# EAGLE schematic iot-gateway-main (EAGLE 9.6.1)
CNAME: PepeTech; CREVISION: 2.0; DESIGNER: Joao Silva

## Sheet 1 of 9: Main MCU
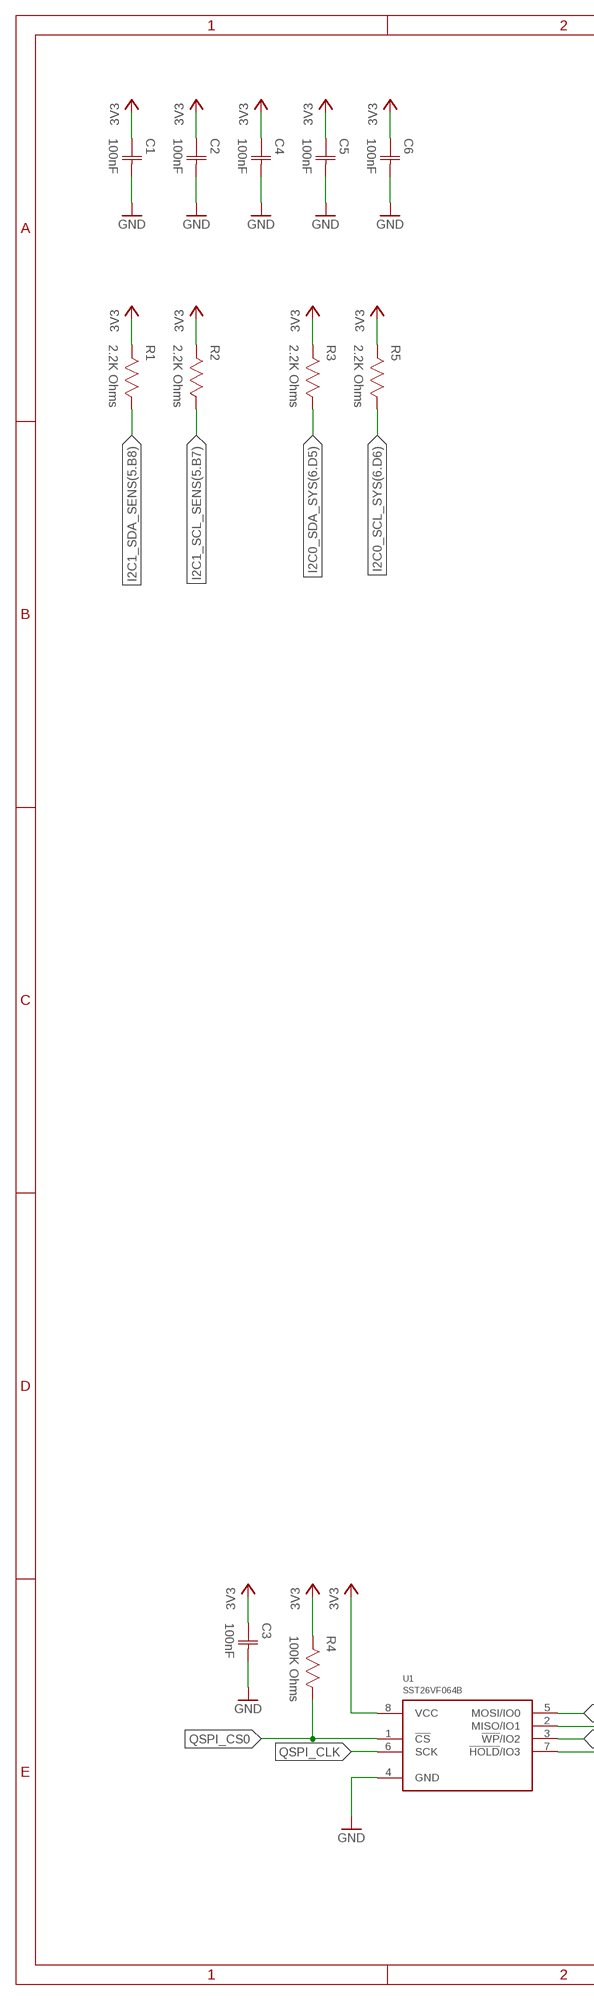
[diagram p0: schematic, sheet 1, part 1 of 2]
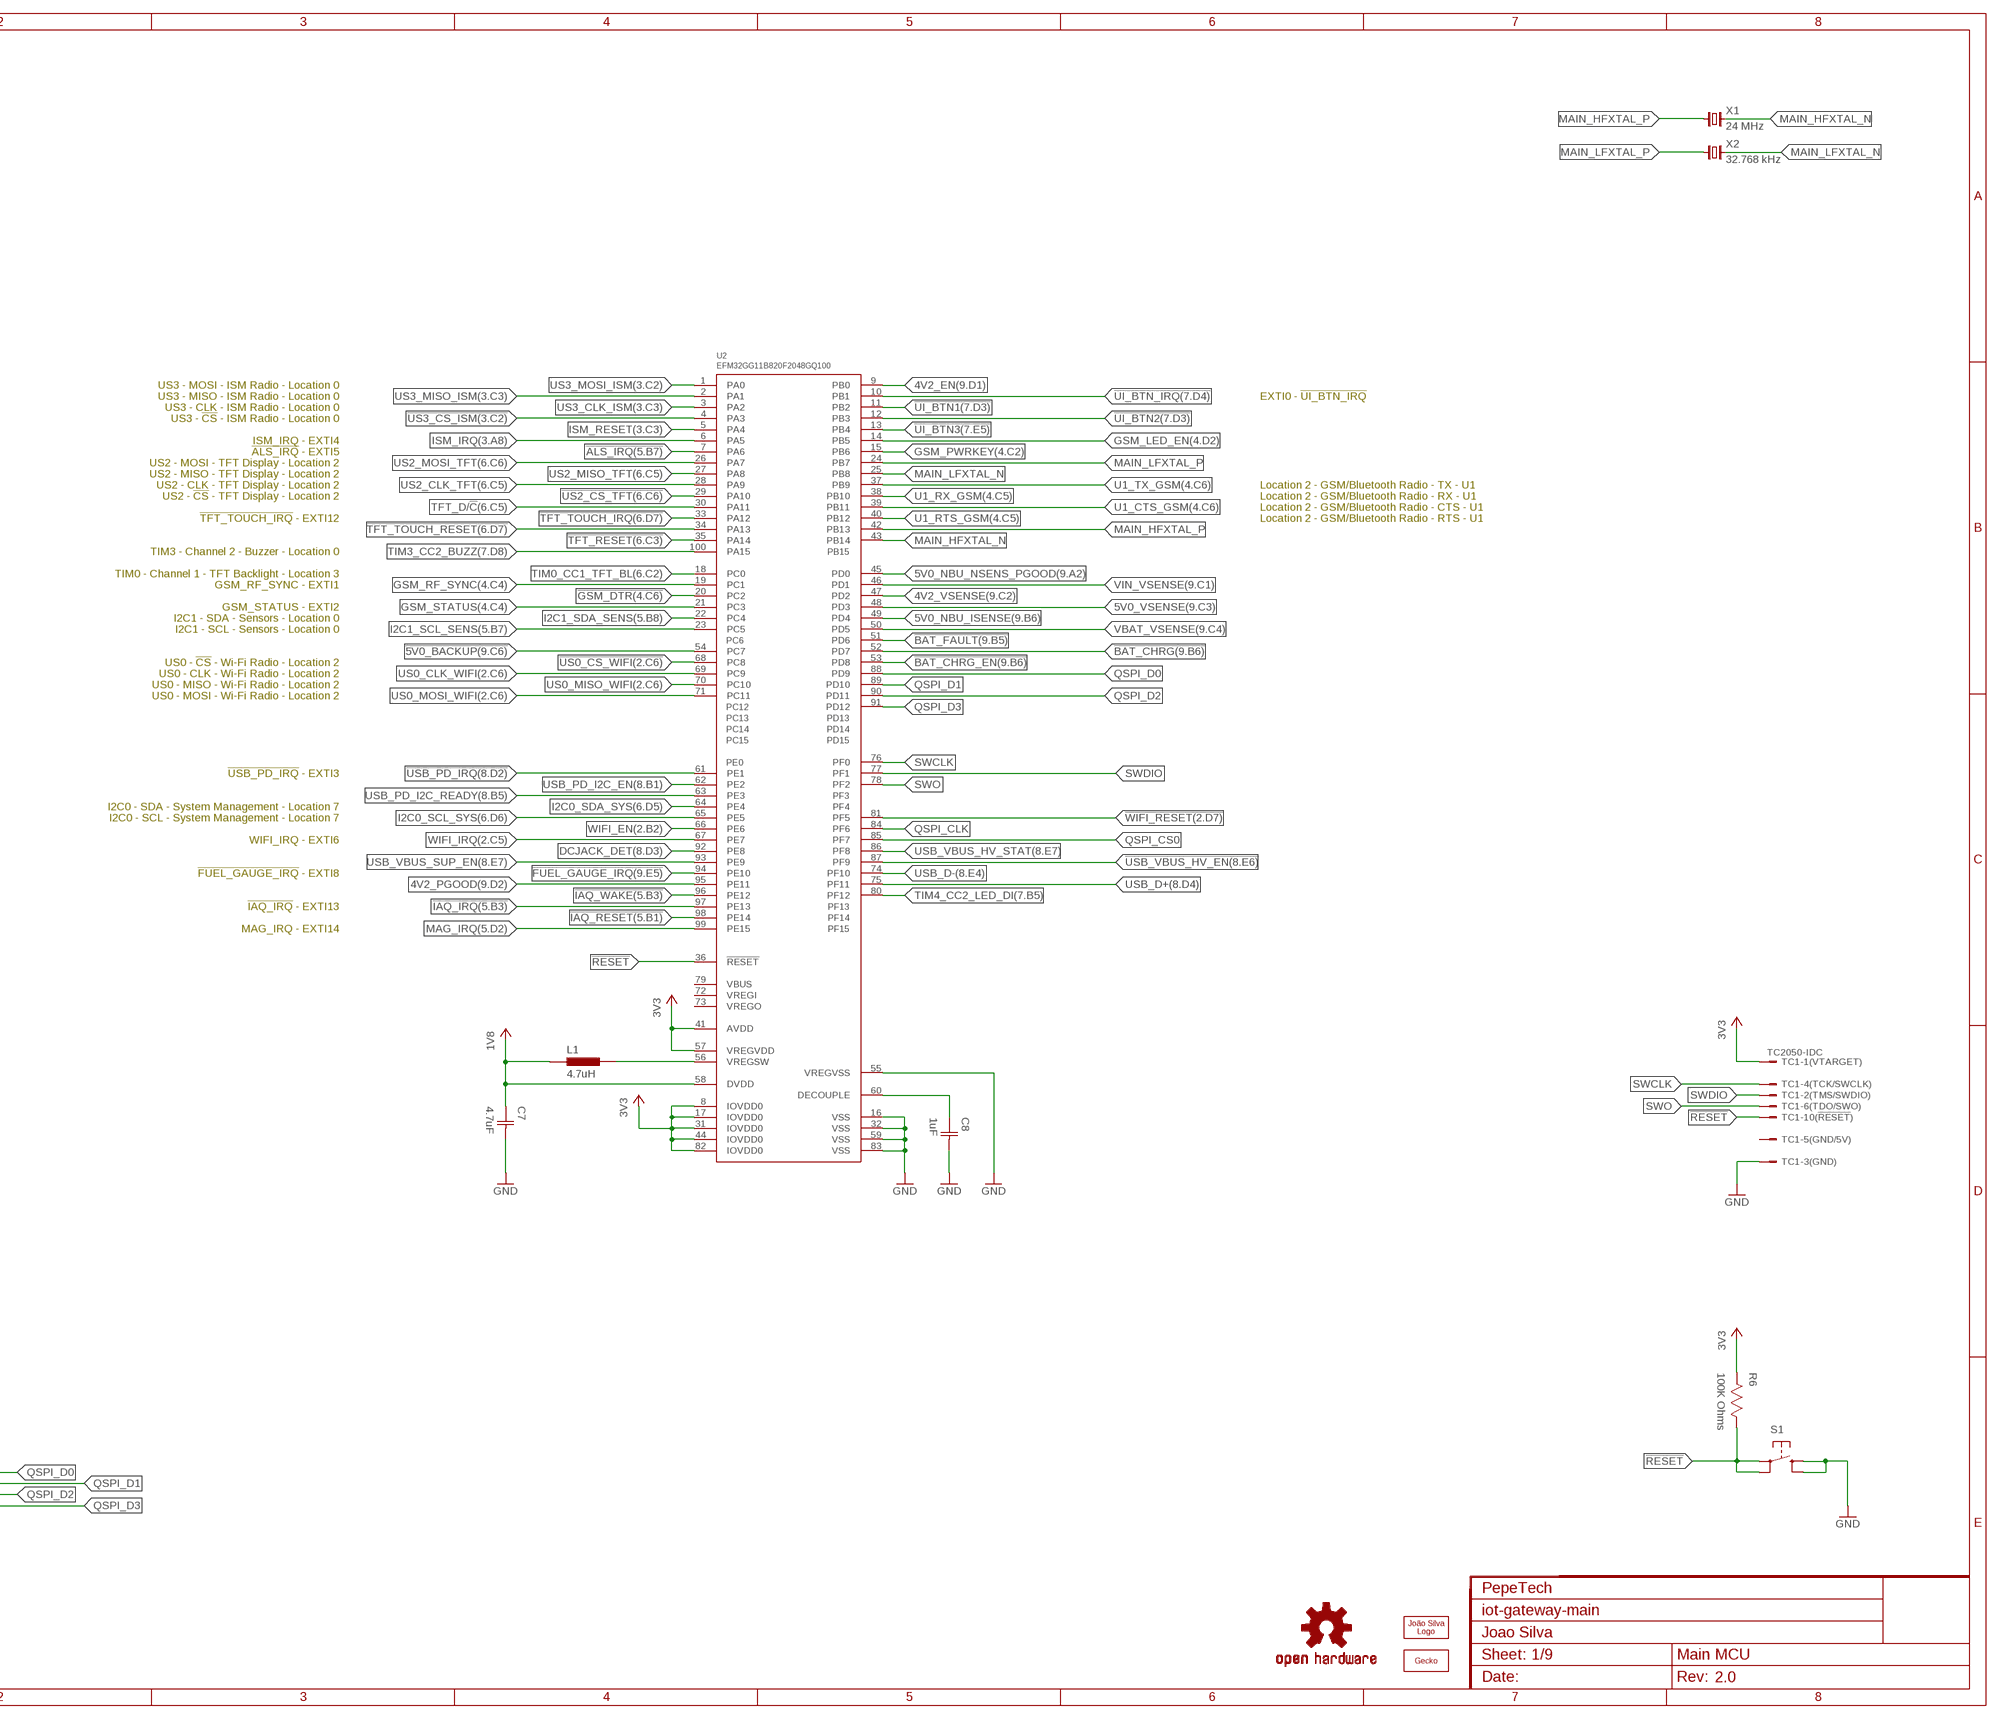
[diagram p1: schematic, sheet 1, part 2 of 2]

### Parts
C1  100nF  CAPACITOR-0603  [CAP0603]
C2  100nF  CAPACITOR-0603  [CAP0603]
C3  100nF  CAPACITOR-0603  [CAP0603]
C4  100nF  CAPACITOR-0603  [CAP0603]
C5  100nF  CAPACITOR-0603  [CAP0603]
C6  100nF  CAPACITOR-0603  [CAP0603]
C7  4.7uF  CAPACITOR-0603  [CAP0603]
C8  1uF  CAPACITOR-0603  [CAP0603]
L1  4.7uH  INDUCTOR-0603  [IND0603]
LOGO1  OSHW-LOGOM  [OSHW-LOGO-M]
LOGO2  JS-10MM  [JS_10MM]
LOGO3  GECKO-14MM  [GECKO_14MM]
R1  2.2K Ohms  RESISTOR-0603  [RES0603]
R2  2.2K Ohms  RESISTOR-0603  [RES0603]
R3  2.2K Ohms  RESISTOR-0603  [RES0603]
R4  100K Ohms  RESISTOR-0603  [RES0603]
R5  2.2K Ohms  RESISTOR-0603  [RES0603]
R6  100K Ohms  RESISTOR-0603  [RES0603]
S1  TAC_SWITCHSMD  [TAC_SW_SMD_RESET]
TC1  TC2050-IDC  [TC2050-IDC]
U1  SST26VF064B  [WSOIC8]
U2  EFM32GG11B820F2048GQ100  [QFP100]
X1  24 MHz  CRYSTAL2-SMD-5032  [2-SMD-5032]
X2  32.768 kHz  CRYSTAL2-SMD-3215  [2-SMD-3215]

### Nets
1V8: C7.1(C1) L1.1 U2.58(DVDD)
3V3: C1.1(C1) C2.1(C1) C3.1(C1) C4.1(C1) C5.1(C1) C6.1(C1) R1.2 R2.2 R3.2 R4.2 R5.2 R6.2 TC1.1 U1.8(VCC) U2.8(IOVDD0) U2.17(IOVDD0) U2.31(IOVDD0) U2.41(AVDD) U2.44(IOVDD0) U2.57(VREGVDD) U2.82(IOVDD0) ; also sheet 2,3,4,5,6,7,8,9
4V2_EN: U2.9(PB0) ; also sheet 9
4V2_PGOOD: U2.95(PE11) ; also sheet 9
4V2_VSENSE: U2.47(PD2) ; also sheet 9
5V0_NBU_ISENSE: U2.49(PD4) ; also sheet 9
5V0_NBU_NSENS_PGOOD: U2.45(PD0) ; also sheet 9
5V0_VSENSE: U2.48(PD3) ; also sheet 9
!5V0_BACKUP: U2.54(PC7) ; also sheet 9
!ALS_IRQ: U2.7(PA6) ; also sheet 5
!BAT_CHRG: U2.52(PD7) ; also sheet 9
!BAT_CHRG_EN: U2.53(PD8) ; also sheet 9
!BAT_FAULT: U2.51(PD6) ; also sheet 9
!FUEL_GAUGE_IRQ: U2.94(PE10) ; also sheet 9
!GSM_DTR: U2.20(PC2) ; also sheet 4
!IAQ_IRQ: U2.97(PE13) ; also sheet 5
!IAQ_RESET: U2.98(PE14) ; also sheet 5
!IAQ_WAKE: U2.96(PE12) ; also sheet 5
!RESET: R6.1 S1.1 S1.2 TC1.10 U2.36(!RESET)
!TFT_RESET: U2.35(PA14) ; also sheet 6
!TFT_TOUCH_IRQ: U2.33(PA12) ; also sheet 6
!TFT_TOUCH_RESET: U2.34(PA13) ; also sheet 6
!UI_BTN1: U2.11(PB2) ; also sheet 7
!UI_BTN2: U2.12(PB3) ; also sheet 7
!UI_BTN3: U2.13(PB4) ; also sheet 7
!UI_BTN_IRQ: U2.10(PB1) ; also sheet 7
!US0_CS_WIFI: U2.68(PC8) ; also sheet 2
!US2_CS_TFT: U2.29(PA10) ; also sheet 6
!US3_CS_ISM: U2.4(PA3) ; also sheet 3
!USB_PD_IRQ: U2.61(PE1) ; also sheet 8
!USB_VBUS_HV_EN: U2.87(PF9) ; also sheet 8
!WIFI_RESET: U2.81(PF5) ; also sheet 2
DCJACK_DET: U2.92(PE8) ; also sheet 8
GND: C1.2(C2) C2.2(C2) C3.2(C2) C4.2(C2) C5.2(C2) C6.2(C2) C7.2(C2) C8.2(C2) S1.3 S1.4 TC1.3 U1.4(GND) U2.16(VSS) U2.32(VSS) U2.55(VREGVSS) U2.59(VSS) U2.83(VSS) ; also sheet 2,3,4,5,6,7,8,9
GSM_LED_EN: U2.14(PB5) ; also sheet 4
GSM_PWRKEY: U2.15(PB6) ; also sheet 4
GSM_RF_SYNC: U2.19(PC1) ; also sheet 4
GSM_STATUS: U2.21(PC3) ; also sheet 4
I2C0_SCL_SYS: R5.1 U2.65(PE5) ; also sheet 6,8,9
I2C0_SDA_SYS: R3.1 U2.64(PE4) ; also sheet 6,8,9
I2C1_SCL_SENS: R2.1 U2.23(PC5) ; also sheet 5
I2C1_SDA_SENS: R1.1 U2.22(PC4) ; also sheet 5
ISM_IRQ: U2.6(PA5) ; also sheet 3
ISM_RESET: U2.5(PA4) ; also sheet 3
MAG_IRQ: U2.99(PE15) ; also sheet 5
MAIN_HFXTAL_N: U2.43(PB14) X1.2
MAIN_HFXTAL_P: U2.42(PB13) X1.1
MAIN_LFXTAL_N: U2.25(PB8) X2.2
MAIN_LFXTAL_P: U2.24(PB7) X2.1
MAIN_VDD_CORE: C8.1(C1) U2.60(DECOUPLE)
MAIN_VREG_SW: L1.2 U2.56(VREGSW)
QSPI_CLK: U1.6(SCK) U2.84(PF6)
QSPI_CS0: R4.1 U1.1(!CS!) U2.85(PF7)
QSPI_D0: U1.5(MOSI/IO0) U2.88(PD9)
QSPI_D1: U1.2(MISO/IO1) U2.89(PD10)
QSPI_D2: U1.3(!WP!/IO2) U2.90(PD11)
QSPI_D3: U1.7(!HOLD!/IO3) U2.91(PD12)
SWCLK: TC1.4 U2.76(PF0)
SWDIO: TC1.2 U2.77(PF1)
SWO: TC1.6 U2.78(PF2)
TFT_D/!C!: U2.30(PA11) ; also sheet 6
TIM0_CC1_TFT_BL: U2.18(PC0) ; also sheet 6
TIM3_CC2_BUZZ: U2.100(PA15) ; also sheet 7
TIM4_CC2_LED_DI: U2.80(PF12) ; also sheet 7
U1_CTS_GSM: U2.39(PB11) ; also sheet 4
U1_RTS_GSM: U2.40(PB12) ; also sheet 4
U1_RX_GSM: U2.38(PB10) ; also sheet 4
U1_TX_GSM: U2.37(PB9) ; also sheet 4
US0_CLK_WIFI: U2.69(PC9) ; also sheet 2
US0_MISO_WIFI: U2.70(PC10) ; also sheet 2
US0_MOSI_WIFI: U2.71(PC11) ; also sheet 2
US2_CLK_TFT: U2.28(PA9) ; also sheet 6
US2_MISO_TFT: U2.27(PA8) ; also sheet 6
US2_MOSI_TFT: U2.26(PA7) ; also sheet 6
US3_CLK_ISM: U2.3(PA2) ; also sheet 3
US3_MISO_ISM: U2.2(PA1) ; also sheet 3
US3_MOSI_ISM: U2.1(PA0) ; also sheet 3
USB_D+: U2.75(PF11) ; also sheet 8
USB_D-: U2.74(PF10) ; also sheet 8
USB_PD_I2C_EN: U2.62(PE2) ; also sheet 8
USB_PD_I2C_READY: U2.63(PE3) ; also sheet 8
USB_VBUS_HV_STAT: U2.86(PF8) ; also sheet 8
USB_VBUS_SUP_EN: U2.93(PE9) ; also sheet 8
VBAT_VSENSE: U2.50(PD5) ; also sheet 9
VIN_VSENSE: U2.46(PD1) ; also sheet 9
WIFI_EN: U2.66(PE6) ; also sheet 2
WIFI_IRQ: U2.67(PE7) ; also sheet 2
Unconnected: TC1.5 TC1.7 TC1.8 TC1.9 U2.72(VREGI) U2.73(VREGO) U2.79(VBUS)

### Notes on the sheet
- US3 - MOSI - ISM Radio - Location 0
- US3 - MISO - ISM Radio - Location 0 | EXTI0 - !UI_BTN_IRQ!
- US3 - CLK - ISM Radio - Location 0
- US3 - !CS! - ISM Radio - Location 0
- ISM_IRQ - EXTI4
- !ALS_IRQ! - EXTI5
- US2 - MOSI - TFT Display - Location 2
- US2 - MISO - TFT Display - Location 2
- US2 - CLK - TFT Display - Location 2 | Location 2 - GSM/Bluetooth Radio - TX - U1
- US2 - !CS! - TFT Display - Location 2 | Location 2 - GSM/Bluetooth Radio - RX - U1
- Location 2 - GSM/Bluetooth Radio - CTS - U1
- !TFT_TOUCH_IRQ! - EXTI12 | Location 2 - GSM/Bluetooth Radio - RTS - U1
- TIM3 - Channel 2 - Buzzer - Location 0
- TIM0 - Channel 1 - TFT Backlight - Location 3
- GSM_RF_SYNC - EXTI1
- GSM_STATUS - EXTI2
- I2C1 - SDA - Sensors - Location 0
- I2C1 - SCL - Sensors - Location 0
- US0 - !CS! - Wi-Fi Radio - Location 2
- US0 - CLK - Wi-Fi Radio - Location 2
- US0 - MISO - Wi-Fi Radio - Location 2
- US0 - MOSI - Wi-Fi Radio - Location 2
- !USB_PD_IRQ! - EXTI3
- I2C0 - SDA - System Management - Location 7
- I2C0 - SCL - System Management - Location 7
- WIFI_IRQ - EXTI6
- !FUEL_GAUGE_IRQ! - EXTI8
- !IAQ_IRQ! - EXTI13
- MAG_IRQ - EXTI14

## Sheet 2 of 9: Wi-Fi Radio
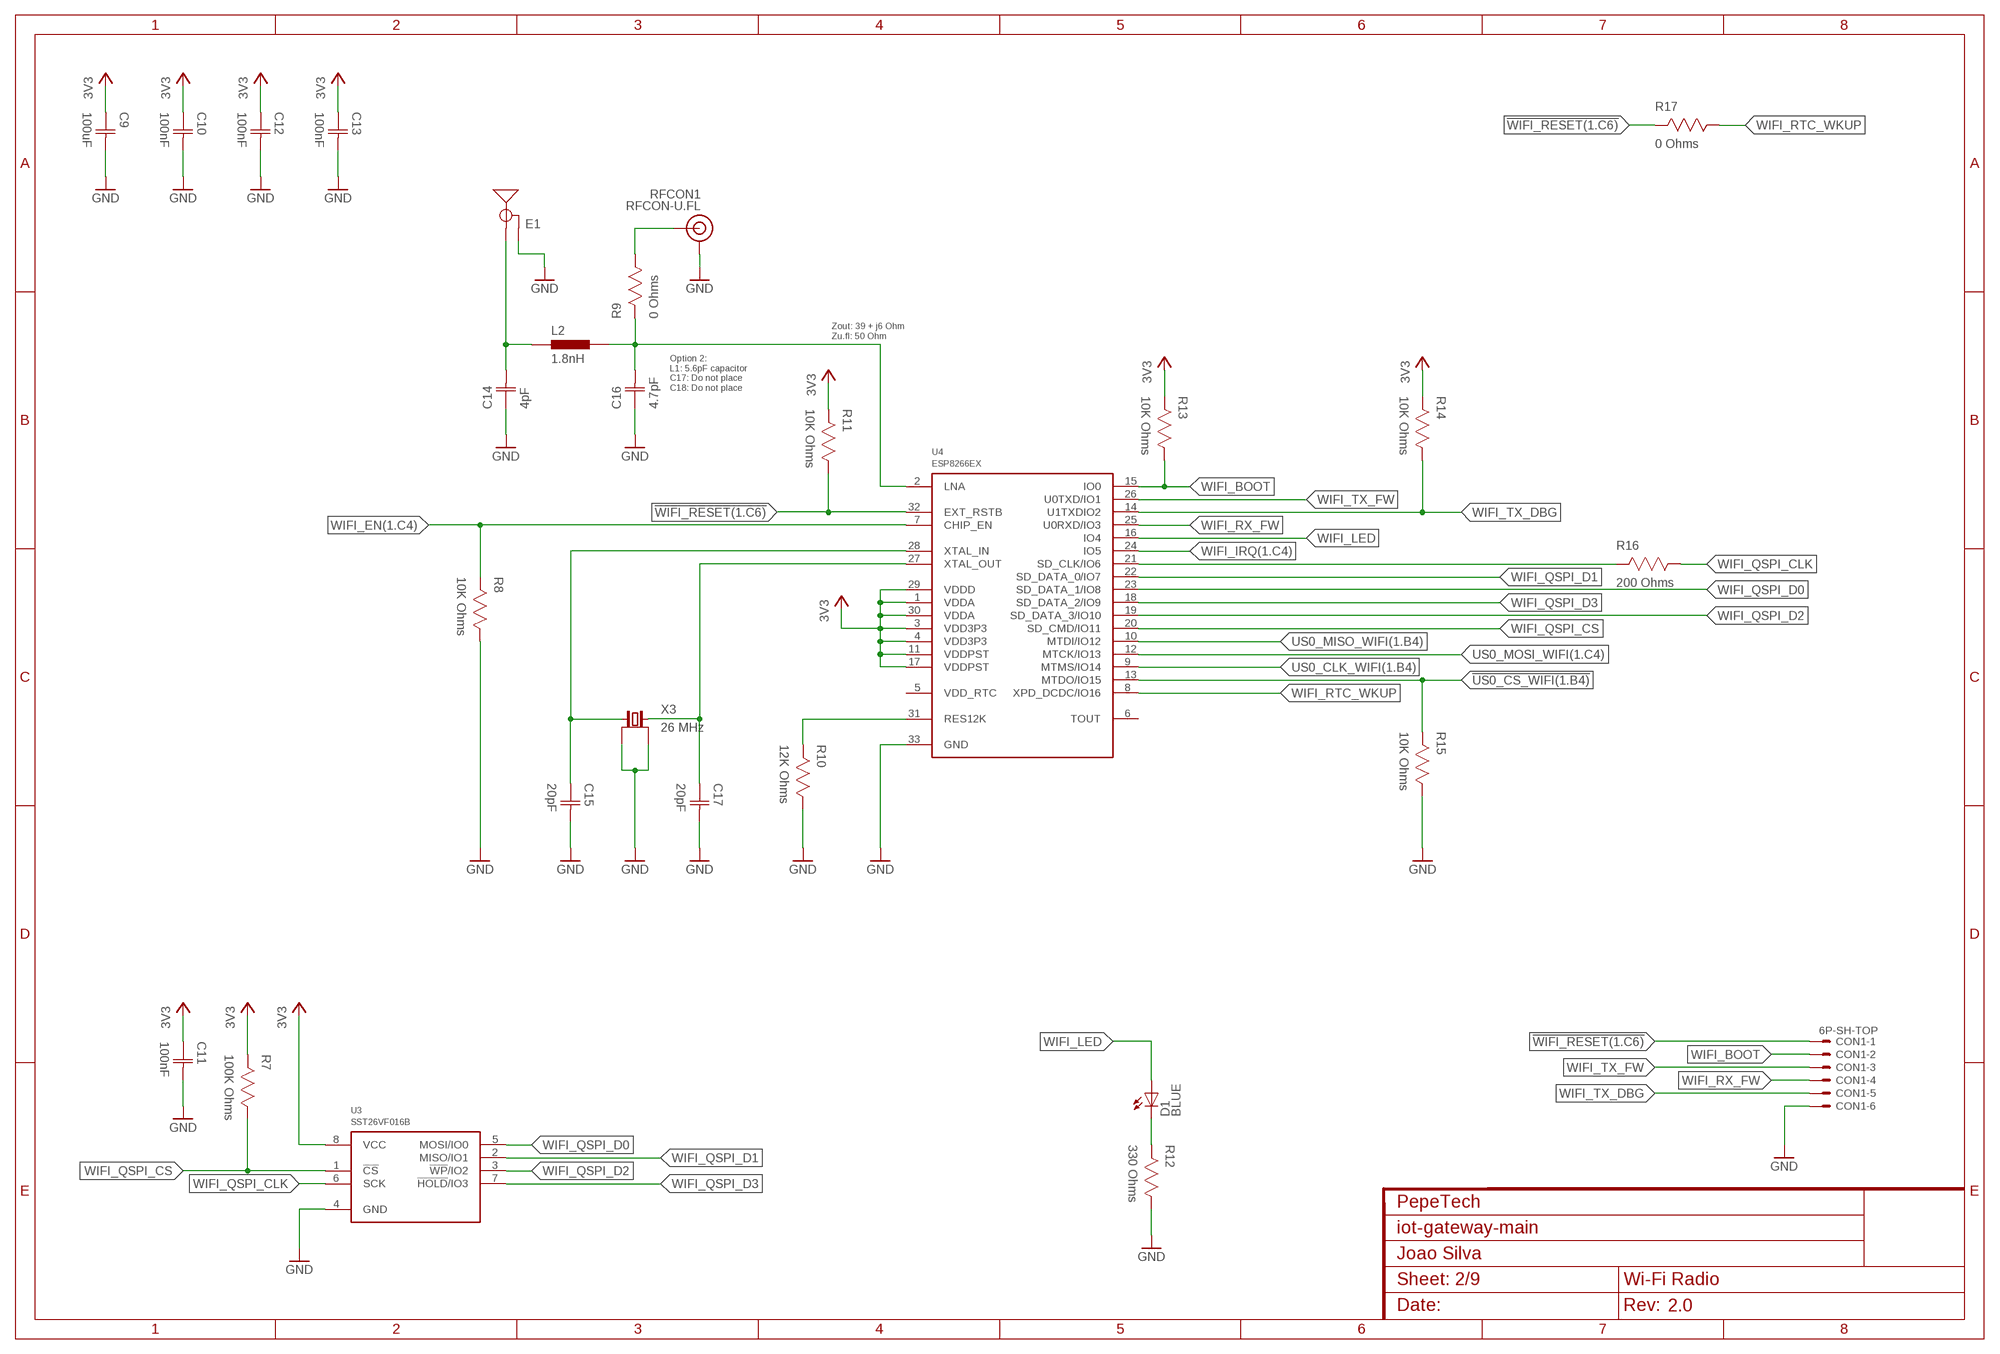
[diagram p2: schematic, sheet 2]

### Parts
C9  100uF  CAPACITOR-1206  [CAP1206]
C10  100nF  CAPACITOR-0603  [CAP0603]
C11  100nF  CAPACITOR-0603  [CAP0603]
C12  100nF  CAPACITOR-0603  [CAP0603]
C13  100nF  CAPACITOR-0603  [CAP0603]
C14  4pF  CAPACITOR-0603  [CAP0603]
C15  20pF  CAPACITOR-0603  [CAP0603]
C16  4.7pF  CAPACITOR-0603  [CAP0603]
C17  20pF  CAPACITOR-0603  [CAP0603]
CON1  6P-SH-TOP  [SH-06-TOP]
D1  BLUE  LED1206-REV  [1206_REV]
E1  2.4GHZTRACE-15.2MM  [TRACE_ANTENNA_2.4GHZ_15.2MM]
L2  1.8nH  INDUCTOR-0603  [IND0603]
R7  100K Ohms  RESISTOR-0603  [RES0603]
R8  10K Ohms  RESISTOR-0603  [RES0603]
R9  0 Ohms  RESISTOR-0603  [RES0603]
R10  12K Ohms  RESISTOR-0603  [RES0603]
R11  10K Ohms  RESISTOR-0603  [RES0603]
R12  330 Ohms  RESISTOR-0603  [RES0603]
R13  10K Ohms  RESISTOR-0603  [RES0603]
R14  10K Ohms  RESISTOR-0603  [RES0603]
R15  10K Ohms  RESISTOR-0603  [RES0603]
R16  200 Ohms  RESISTOR-0603  [RES0603]
R17  0 Ohms  RESISTOR-0603  [RES0603]
RFCON1  RFCON-U.FL  [U.FL]
U3  SST26VF016B  [WSOIC8]
U4  ESP8266EX  [QFN32]
X3  26 MHz  CRYSTAL_4P  [4-SMD-3225]

### Nets
3V3: C9.1(C1) C10.1(C1) C11.1(C1) C12.1(C1) C13.1(C1) R7.2 R11.2 R13.2 R14.2 U3.8(VCC) U4.1(VDDA) U4.3(VDD3P3) U4.4(VDD3P3) U4.11(VDDPST) U4.17(VDDPST) U4.29(VDDD) U4.30(VDDA) ; also sheet 1,3,4,5,6,7,8,9
!US0_CS_WIFI: R15.2 U4.13(MTDO/IO15) ; also sheet 1
!WIFI_RESET: CON1.1 R11.1 R17.2 U4.32(EXT_RSTB) ; also sheet 1
GND: C9.2(C2) C10.2(C2) C11.2(C2) C12.2(C2) C13.2(C2) C14.1(C1) C15.2(C2) C16.1(C1) C17.2(C2) CON1.6 E1.GND R8.1 R10.1 R12.1 R15.1 RFCON1.P$1(GND) RFCON1.P$2(GND) U3.4(GND) U4.33(GND) X3.1(GND) X3.3(GND) ; also sheet 1,3,4,5,6,7,8,9
N$29: D1.C R12.2
US0_CLK_WIFI: U4.9(MTMS/IO14) ; also sheet 1
US0_MISO_WIFI: U4.10(MTDI/IO12) ; also sheet 1
US0_MOSI_WIFI: U4.12(MTCK/IO13) ; also sheet 1
WIFI_ANT: C16.2(C2) L2.2 R9.2 U4.2(LNA)
WIFI_ANT_EXT: R9.1 RFCON1.P$3(SIGNAL)
WIFI_ANT_FILT: C14.2(C2) E1.ANT(SIGNAL) L2.1
WIFI_BIAS: R10.2 U4.31(RES12K)
WIFI_BOOT: CON1.2 R13.1 U4.15(IO0)
WIFI_EN: R8.2 U4.7(CHIP_EN) ; also sheet 1
WIFI_IRQ: U4.24(IO5) ; also sheet 1
WIFI_LED: D1.A U4.16(IO4)
WIFI_QSPI_CLK: R16.1 U3.6(SCK)
WIFI_QSPI_CLK_FILT: R16.2 U4.21(SD_CLK/IO6)
WIFI_QSPI_CS: R7.1 U3.1(!CS!) U4.20(SD_CMD/IO11)
WIFI_QSPI_D0: U3.5(MOSI/IO0) U4.23(SD_DATA_1/IO8)
WIFI_QSPI_D1: U3.2(MISO/IO1) U4.22(SD_DATA_0/IO7)
WIFI_QSPI_D2: U3.3(!WP!/IO2) U4.19(SD_DATA_3/IO10)
WIFI_QSPI_D3: U3.7(!HOLD!/IO3) U4.18(SD_DATA_2/IO9)
WIFI_RTC_WKUP: R17.1 U4.8(XPD_DCDC/IO16)
WIFI_RX_FW: CON1.4 U4.25(U0RXD/IO3)
WIFI_TX_DBG: CON1.5 R14.1 U4.14(U1TXDIO2)
WIFI_TX_FW: CON1.3 U4.26(U0TXD/IO1)
WIFI_XTAL_IN: C15.1(C1) U4.28(XTAL_IN) X3.2
WIFI_XTAL_OUT: C17.1(C1) U4.27(XTAL_OUT) X3.4
Unconnected: U4.5(VDD_RTC) U4.6(TOUT)

### Notes on the sheet
- Zout: 39 + j6 Ohm
  Zu.fl: 50 Ohm
- Option 2:
  L1: 5.6pF capacitor
  C17: Do not place
  C18: Do not place

## Sheet 3 of 9: ISM Radio
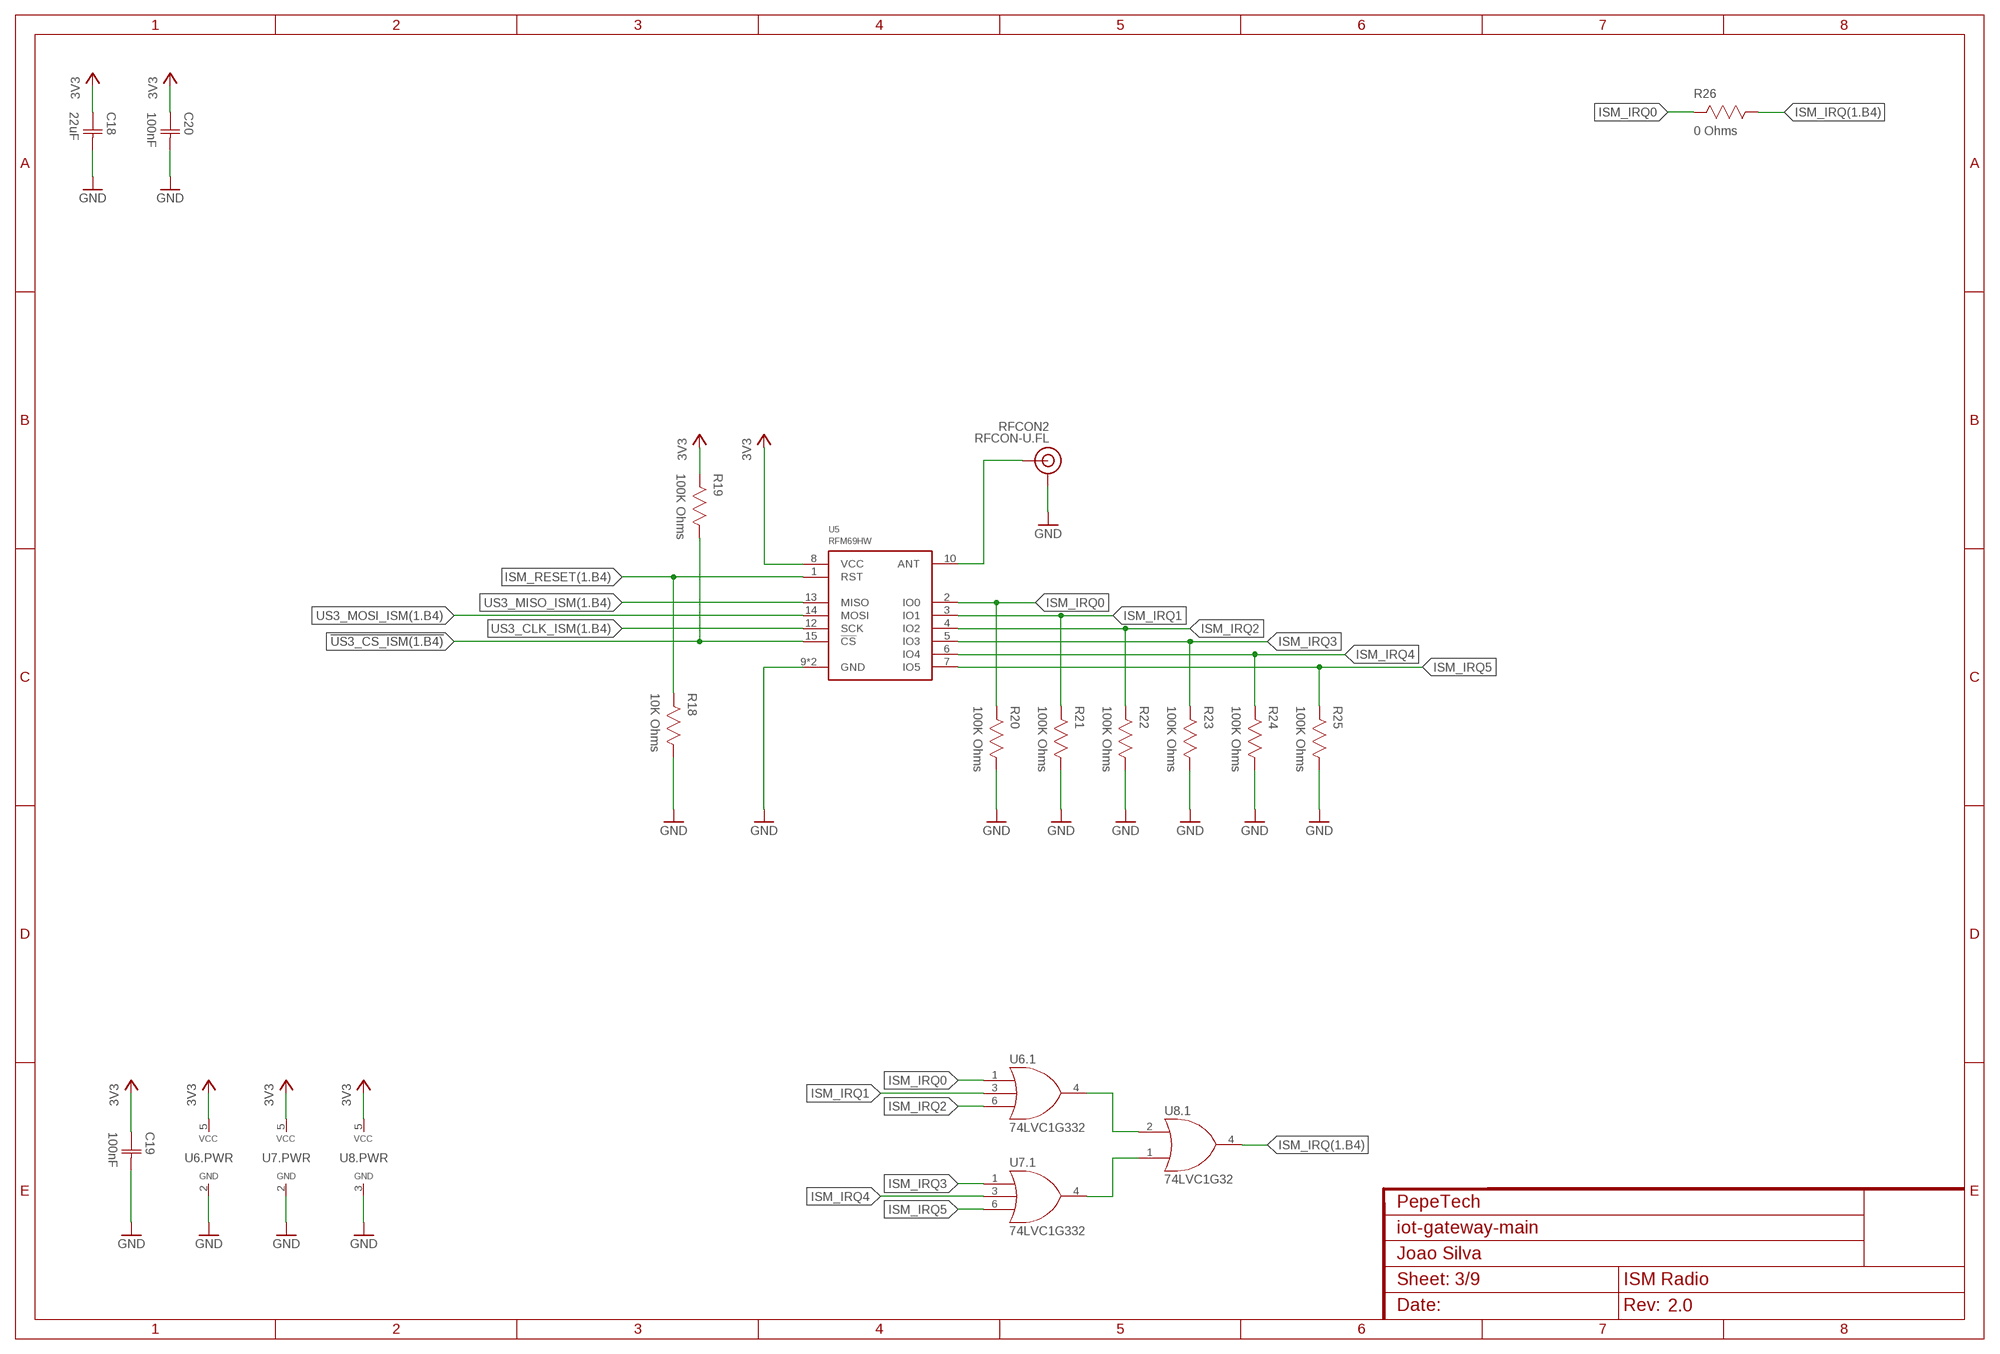
[diagram p3: schematic, sheet 3]

### Parts
C18  22uF  CAPACITOR-1206  [CAP1206]
C19  100nF  CAPACITOR-0603  [CAP0603]
C20  100nF  CAPACITOR-0603  [CAP0603]
R18  10K Ohms  RESISTOR-0603  [RES0603]
R19  100K Ohms  RESISTOR-0603  [RES0603]
R20  100K Ohms  RESISTOR-0603  [RES0603]
R21  100K Ohms  RESISTOR-0603  [RES0603]
R22  100K Ohms  RESISTOR-0603  [RES0603]
R23  100K Ohms  RESISTOR-0603  [RES0603]
R24  100K Ohms  RESISTOR-0603  [RES0603]
R25  100K Ohms  RESISTOR-0603  [RES0603]
R26  0 Ohms  RESISTOR-0603  [RES0603]
RFCON2  RFCON-U.FL  [U.FL]
U5  RFM69HW  [RFM69XW-XXXS2]
U6  74LVC1G332  [SC70-6]
U7  74LVC1G332  [SC70-6]
U8  74LVC1G32  [SC70-5]

### Nets
3V3: C18.1(C1) C19.1(C1) C20.1(C1) R19.2 U5.8(VCC) U6.5(.PWR:VCC) U7.5(.PWR:VCC) U8.5(.PWR:VCC) ; also sheet 1,2,4,5,6,7,8,9
!US3_CS_ISM: R19.1 U5.15(!CS) ; also sheet 1
GND: C18.2(C2) C19.2(C2) C20.2(C2) R18.1 R20.1 R21.1 R22.1 R23.1 R24.1 R25.1 RFCON2.P$1(GND) RFCON2.P$2(GND) U5.9(GND) U5.11(GND) U6.2(.PWR:GND) U7.2(.PWR:GND) U8.3(.PWR:GND) ; also sheet 1,2,4,5,6,7,8,9
ISM_IRQ: R26.1 U8.4(.1:Y) ; also sheet 1
ISM_IRQ0: R20.2 R26.2 U5.2(IO0) U6.1(.1:A)
ISM_IRQ1: R21.2 U5.3(IO1) U6.3(.1:B)
ISM_IRQ2: R22.2 U5.4(IO2) U6.6(.1:C)
ISM_IRQ3: R23.2 U5.5(IO3) U7.1(.1:A)
ISM_IRQ4: R24.2 U5.6(IO4) U7.3(.1:B)
ISM_IRQ5: R25.2 U5.7(IO5) U7.6(.1:C)
ISM_IRQ012: U6.4(.1:Y) U8.2(.1:A)
ISM_IRQ345: U7.4(.1:Y) U8.1(.1:B)
ISM_RESET: R18.2 U5.1(RST) ; also sheet 1
N$45: RFCON2.P$3(SIGNAL) U5.10(ANT)
US3_CLK_ISM: U5.12(SCK) ; also sheet 1
US3_MISO_ISM: U5.13(MISO) ; also sheet 1
US3_MOSI_ISM: U5.14(MOSI) ; also sheet 1

## Sheet 4 of 9: GSM/Bluetooth Module
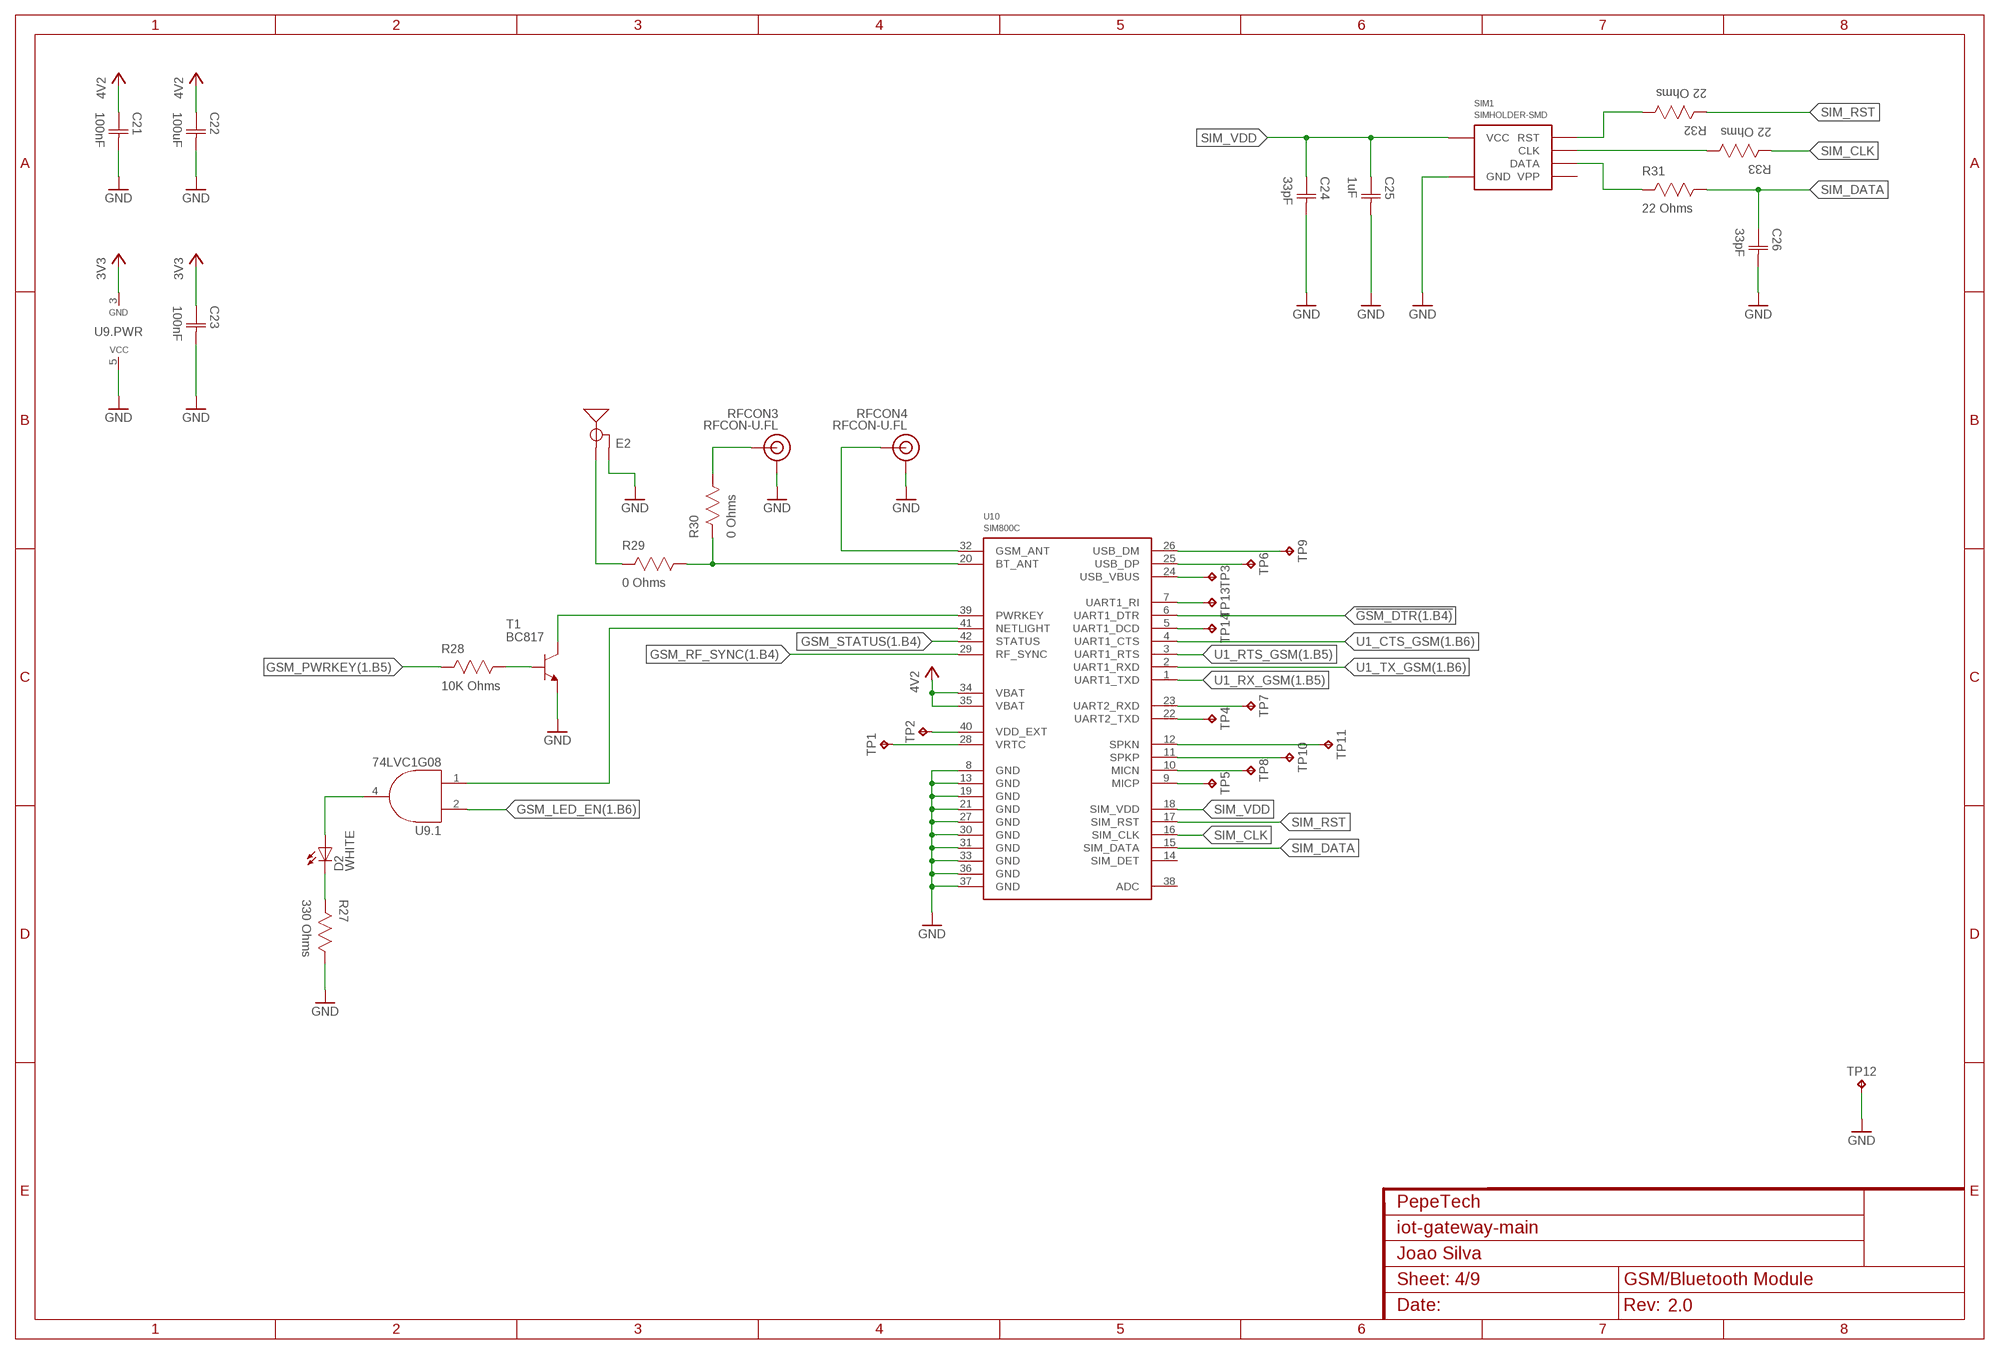
[diagram p4: schematic, sheet 4]

### Parts
C21  100nF  CAPACITOR-0603  [CAP0603]
C22  100uF  CAPACITOR-1206  [CAP1206]
C23  100nF  CAPACITOR-0603  [CAP0603]
C24  33pF  CAPACITOR-0603  [CAP0603]
C25  1uF  CAPACITOR-0603  [CAP0603]
C26  33pF  CAPACITOR-0603  [CAP0603]
D2  WHITE  LED1206-REV  [1206_REV]
E2  2.4GHZTRACE-15.2MM  [TRACE_ANTENNA_2.4GHZ_15.2MM]
R27  330 Ohms  RESISTOR-0603  [RES0603]
R28  10K Ohms  RESISTOR-0603  [RES0603]
R29  0 Ohms  RESISTOR-0603  [RES0603]
R30  0 Ohms  RESISTOR-0603  [RES0603]
R31  22 Ohms  RESISTOR-0603  [RES0603]
R32  22 Ohms  RESISTOR-0603  [RES0603]
R33  22 Ohms  RESISTOR-0603  [RES0603]
RFCON3  RFCON-U.FL  [U.FL]
RFCON4  RFCON-U.FL  [U.FL]
SIM1  SIMHOLDER-SMD  [SIMHOLDER-SMD]
T1  BC817  [SOT23]
TP1  TESTPOINT-1.27MM  [PAD1.27MM]
TP2  TESTPOINT-1.27MM  [PAD1.27MM]
TP3  TESTPOINT-1.27MM  [PAD1.27MM]
TP4  TESTPOINT-1.27MM  [PAD1.27MM]
TP5  TESTPOINT-1.27MM  [PAD1.27MM]
TP6  TESTPOINT-1.27MM  [PAD1.27MM]
TP7  TESTPOINT-1.27MM  [PAD1.27MM]
TP8  TESTPOINT-1.27MM  [PAD1.27MM]
TP9  TESTPOINT-1.27MM  [PAD1.27MM]
TP10  TESTPOINT-1.27MM  [PAD1.27MM]
TP11  TESTPOINT-1.27MM  [PAD1.27MM]
TP12  TESTPOINT-1.27MM  [PAD1.27MM]
TP13  TESTPOINT-1.27MM  [PAD1.27MM]
TP14  TESTPOINT-1.27MM  [PAD1.27MM]
U9  74LVC1G08  [SC70-5]
U10  SIM800C  [SIM800C]

### Nets
3V3: C23.1(C1) U9.3(.PWR:GND) ; also sheet 1,2,3,5,6,7,8,9
4V2: C21.1(C1) C22.1(C1) U10.34(VBAT) U10.35(VBAT) ; also sheet 9
!GSM_DCD: TP14.TP U10.5(UART1_DCD)
!GSM_DTR: U10.6(UART1_DTR) ; also sheet 1
!GSM_PWRKEY: T1.3(C) U10.39(PWRKEY)
!GSM_RING: TP13.TP U10.7(UART1_RI)
BT_ANT: R29.1 R30.2 U10.20(BT_ANT)
BT_ANT_EXT: R30.1 RFCON3.P$3(SIGNAL)
BT_ANT_INT: E2.ANT(SIGNAL) R29.2
GND: C21.2(C2) C22.2(C2) C23.2(C2) C24.2(C2) C25.2(C2) C26.2(C2) E2.GND R27.1 RFCON3.P$1(GND) RFCON3.P$2(GND) RFCON4.P$1(GND) RFCON4.P$2(GND) SIM1.C5(GND) T1.2(E) TP12.TP U9.5(.PWR:VCC) U10.8(GND) U10.13(GND) U10.19(GND) U10.21(GND) U10.27(GND) U10.30(GND) U10.31(GND) U10.33(GND) U10.36(GND) U10.37(GND) ; also sheet 1,2,3,5,6,7,8,9
GSM_2V8: TP2.TP U10.40(VDD_EXT)
GSM_ANT: RFCON4.P$3(SIGNAL) U10.32(GSM_ANT)
GSM_LED: D2.A U9.4(.1:Y)
GSM_LED_EN: U9.2(.1:A) ; also sheet 1
GSM_MIC+: TP5.TP U10.9(MICP)
GSM_MIC-: TP8.TP U10.10(MICN)
GSM_NETLIGHT: U9.1(.1:B) U10.41(NETLIGHT)
GSM_PWRKEY: R28.2 ; also sheet 1
GSM_RF_SYNC: U10.29(RF_SYNC) ; also sheet 1
GSM_SPK+: TP10.TP U10.11(SPKP)
GSM_SPK-: TP11.TP U10.12(SPKN)
GSM_STATUS: U10.42(STATUS) ; also sheet 1
GSM_UART2_RX: TP7.TP U10.23(UART2_RXD)
GSM_UART2_TX: TP4.TP U10.22(UART2_TXD)
GSM_USB_D+: TP6.TP U10.25(USB_DP)
GSM_USB_D-: TP9.TP U10.26(USB_DM)
GSM_USB_VBUS: TP3.TP U10.24(USB_VBUS)
GSM_VRTC: TP1.TP U10.28(VRTC)
N$16: D2.C R27.2
N$28: R28.1 T1.1(B)
SIM_CLK: R33.2 U10.16(SIM_CLK)
SIM_CLK_FILT: R33.1 SIM1.C3(CLK)
SIM_DATA: C26.1(C1) R31.1 U10.15(SIM_DATA)
SIM_DATA_FILT: R31.2 SIM1.C7(DATA)
SIM_RST: R32.2 U10.17(SIM_RST)
SIM_RST_FILT: R32.1 SIM1.C2(RST)
SIM_VDD: C24.1(C1) C25.1(C1) SIM1.C1(VCC) U10.18(SIM_VDD)
U1_CTS_GSM: U10.4(UART1_CTS) ; also sheet 1
U1_RTS_GSM: U10.3(UART1_RTS) ; also sheet 1
U1_RX_GSM: U10.1(UART1_TXD) ; also sheet 1
U1_TX_GSM: U10.2(UART1_RXD) ; also sheet 1
Unconnected: SIM1.C6(VPP) U10.14(SIM_DET) U10.38(ADC)

## Sheet 5 of 9: Digital sensors
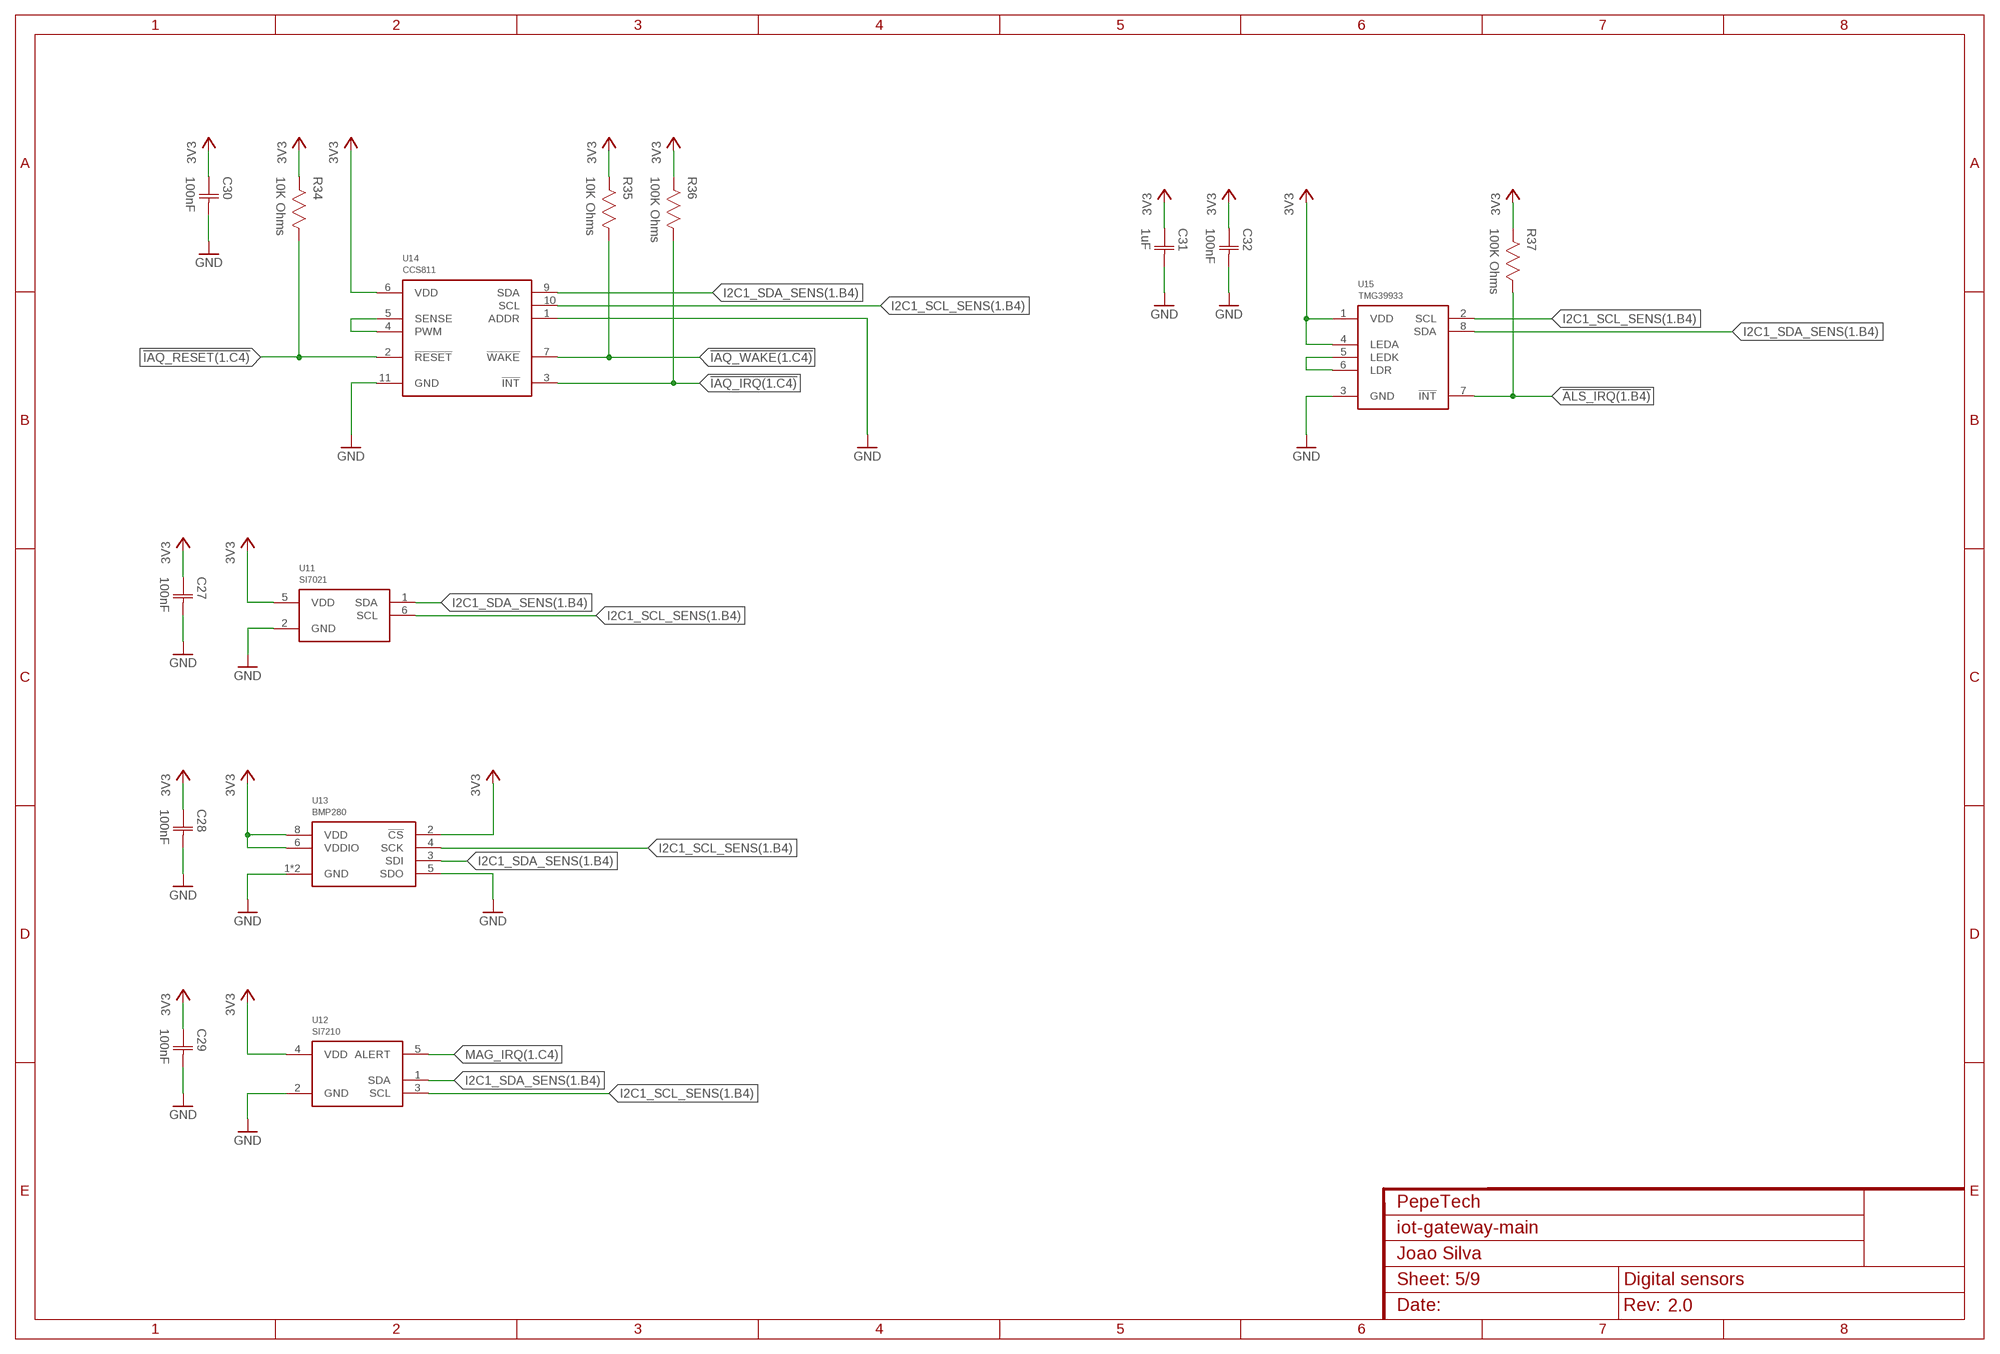
[diagram p5: schematic, sheet 5]

### Parts
C27  100nF  CAPACITOR-0603  [CAP0603]
C28  100nF  CAPACITOR-0603  [CAP0603]
C29  100nF  CAPACITOR-0603  [CAP0603]
C30  100nF  CAPACITOR-0603  [CAP0603]
C31  1uF  CAPACITOR-0603  [CAP0603]
C32  100nF  CAPACITOR-0603  [CAP0603]
R34  10K Ohms  RESISTOR-0603  [RES0603]
R35  10K Ohms  RESISTOR-0603  [RES0603]
R36  100K Ohms  RESISTOR-0603  [RES0603]
R37  100K Ohms  RESISTOR-0603  [RES0603]
U11  SI7021  [DFN6]
U12  SI7210  [SOT23-5]
U13  BMP280  [BMP280]
U14  CCS811  [LGA10]
U15  TMG39933  [LGA8]

### Nets
3V3: C27.1(C1) C28.1(C1) C29.1(C1) C30.1(C1) C31.1(C1) C32.1(C1) R34.2 R35.2 R36.2 R37.2 U11.5(VDD) U12.4(VDD) U13.2(!CS) U13.6(VDDIO) U13.8(VDD) U14.6(VDD) U15.1(VDD) U15.4(LEDA) ; also sheet 1,2,3,4,6,7,8,9
!ALS_IRQ: R37.1 U15.7(!INT) ; also sheet 1
!IAQ_IRQ: R36.1 U14.3(!INT) ; also sheet 1
!IAQ_RESET: R34.1 U14.2(!RESET) ; also sheet 1
!IAQ_WAKE: R35.1 U14.7(!WAKE) ; also sheet 1
CCS811_HEATER_PWM: U14.4(PWM) U14.5(SENSE)
GND: C27.2(C2) C28.2(C2) C29.2(C2) C30.2(C2) C31.2(C2) C32.2(C2) U11.2(GND) U12.2(GND) U13.1(GND) U13.5(SDO) U13.7(GND) U14.1(ADDR) U14.11(GND) U15.3(GND) ; also sheet 1,2,3,4,6,7,8,9
I2C1_SCL_SENS: U11.6(SCL) U12.3(SCL) U13.4(SCK) U14.10(SCL) U15.2(SCL) ; also sheet 1
I2C1_SDA_SENS: U11.1(SDA) U12.1(SDA) U13.3(SDI) U14.9(SDA) U15.8(SDA) ; also sheet 1
MAG_IRQ: U12.5(ALERT) ; also sheet 1
N$2: U15.5(LEDK) U15.6(LDR)

## Sheet 6 of 9: TFT Display
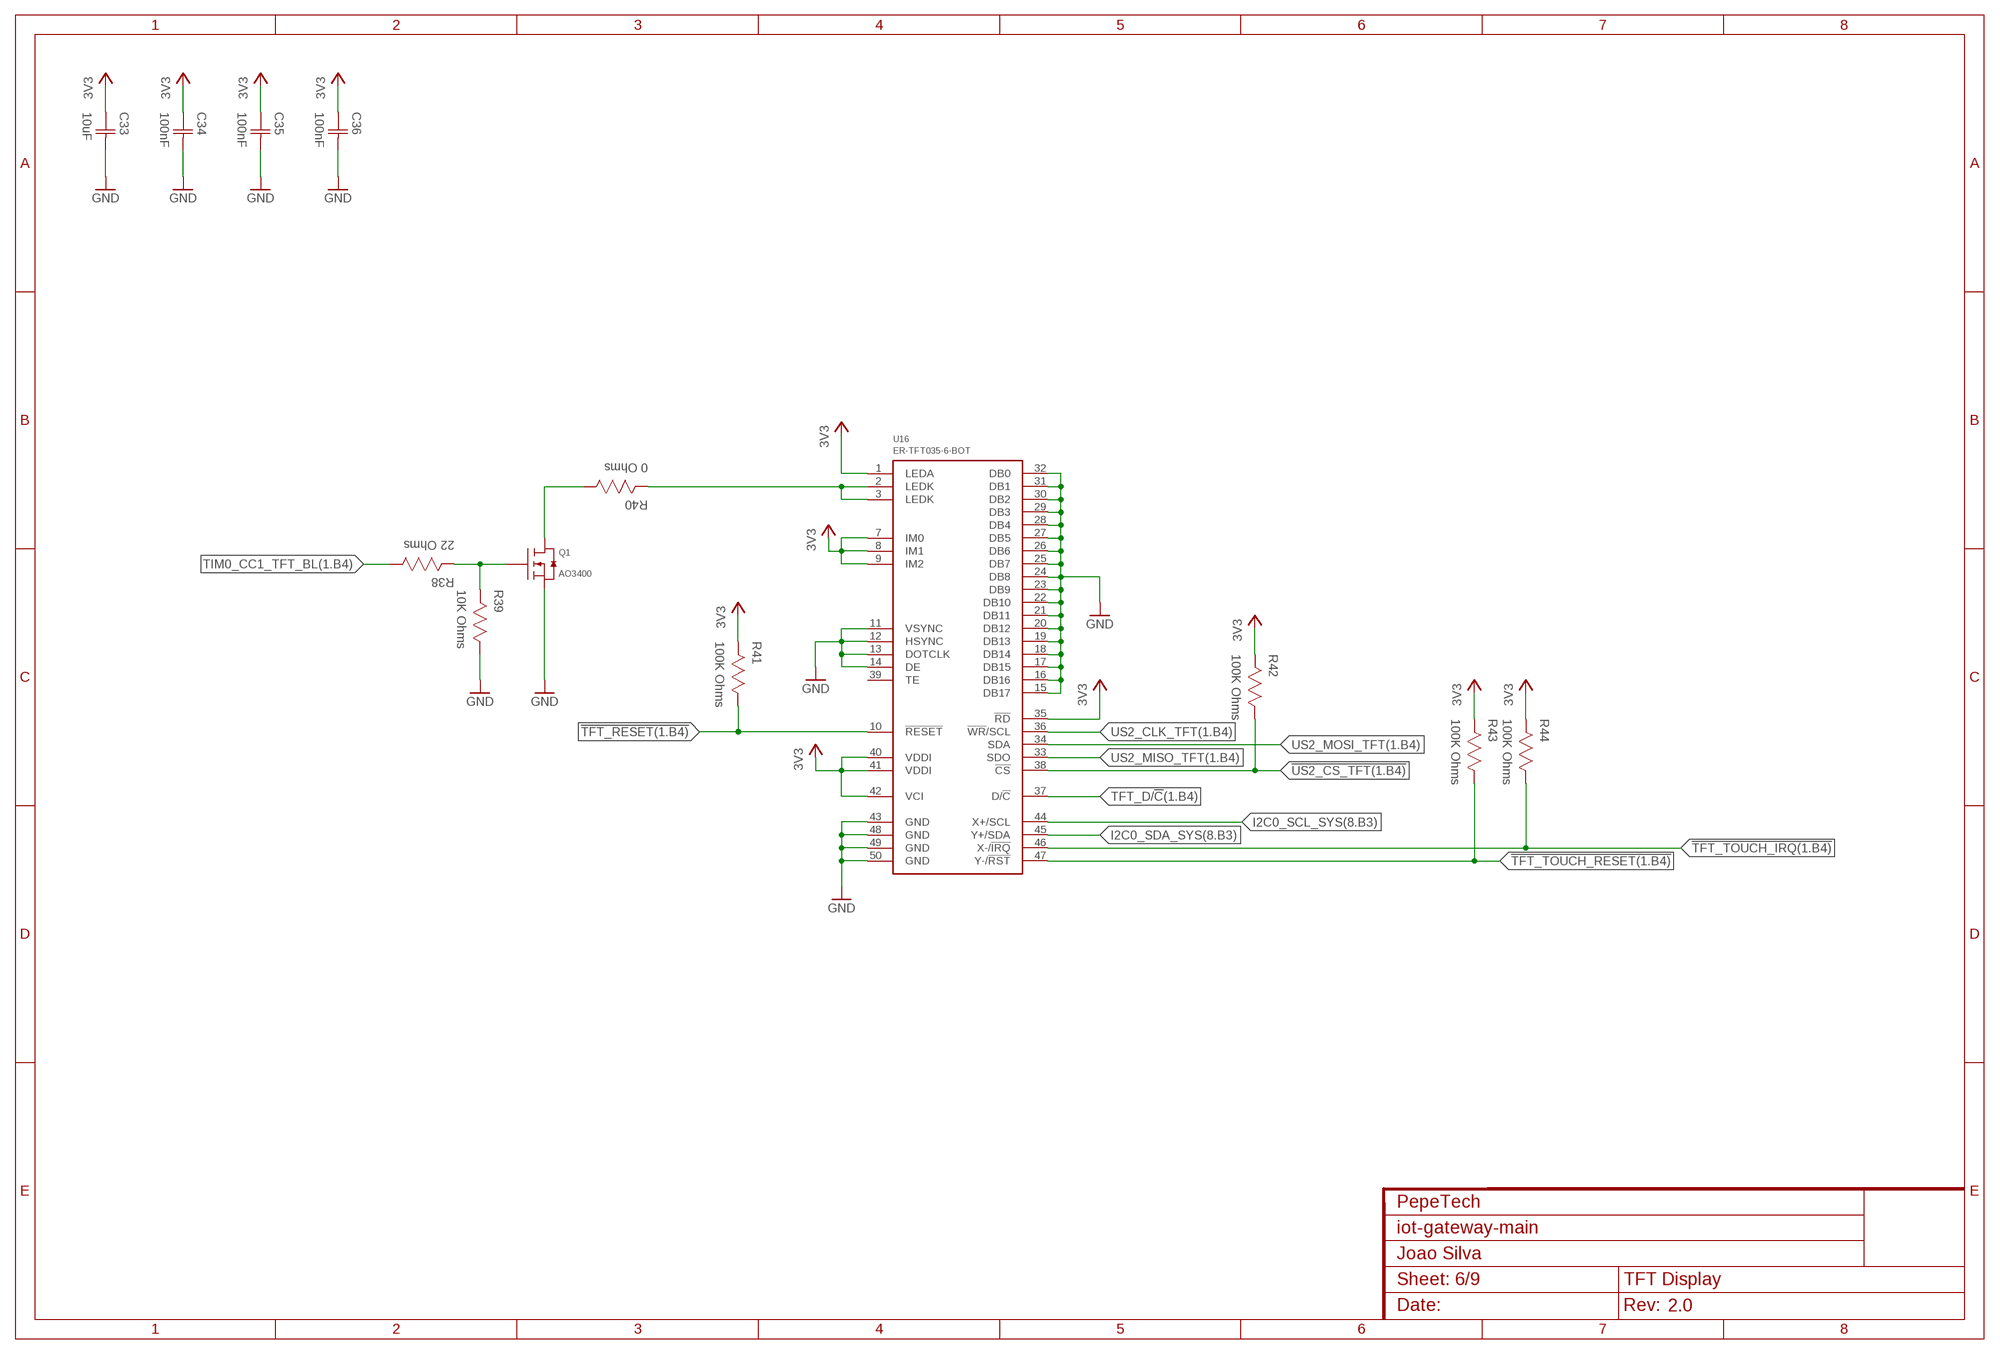
[diagram p6: schematic, sheet 6]

### Parts
C33  10uF  CAPACITOR-0603  [CAP0603]
C34  100nF  CAPACITOR-0603  [CAP0603]
C35  100nF  CAPACITOR-0603  [CAP0603]
C36  100nF  CAPACITOR-0603  [CAP0603]
Q1  AO3400  [SOT23]
R38  22 Ohms  RESISTOR-0603  [RES0603]
R39  10K Ohms  RESISTOR-0603  [RES0603]
R40  0 Ohms  RESISTOR-0603  [RES0603]
R41  100K Ohms  RESISTOR-0603  [RES0603]
R42  100K Ohms  RESISTOR-0603  [RES0603]
R43  100K Ohms  RESISTOR-0603  [RES0603]
R44  100K Ohms  RESISTOR-0603  [RES0603]
U16  ER-TFT035-6-BOT  [FPC-50P-TFT-BOT]

### Nets
3V3: C33.1(C1) C34.1(C1) C35.1(C1) C36.1(C1) R41.2 R42.2 R43.2 R44.2 U16.1(LEDA) U16.7(IM0) U16.8(IM1) U16.9(IM2) U16.35(!RD) U16.40(VDDI) U16.41(VDDI) U16.42(VCI) ; also sheet 1,2,3,4,5,7,8,9
!TFT_RESET: R41.1 U16.10(!RESET) ; also sheet 1
!TFT_TOUCH_IRQ: R44.1 U16.46(X-/!IRQ!) ; also sheet 1
!TFT_TOUCH_RESET: R43.1 U16.47(Y-/!RST!) ; also sheet 1
!US2_CS_TFT: R42.1 U16.38(!CS) ; also sheet 1
GND: C33.2(C2) C34.2(C2) C35.2(C2) C36.2(C2) Q1.2(S) R39.1 U16.11(VSYNC) U16.12(HSYNC) U16.13(DOTCLK) U16.14(DE) U16.15(DB17) U16.16(DB16) U16.17(DB15) U16.18(DB14) U16.19(DB13) U16.20(DB12) U16.21(DB11) U16.22(DB10) U16.23(DB9) U16.24(DB8) U16.25(DB7) U16.26(DB6) U16.27(DB5) U16.28(DB4) U16.29(DB3) U16.30(DB2) U16.31(DB1) U16.32(DB0) U16.43(GND) U16.48(GND) U16.49(GND) U16.50(GND) ; also sheet 1,2,3,4,5,7,8,9
I2C0_SCL_SYS: U16.44(X+/SCL) ; also sheet 1,8,9
I2C0_SDA_SYS: U16.45(Y+/SDA) ; also sheet 1,8,9
N$24: Q1.1(G) R38.2 R39.2
TFT_BACKLIGHT_DRIVER: Q1.3(D) R40.1
TFT_BACKLIGHT_PWM: R40.2 U16.2(LEDK) U16.3(LEDK)
TFT_D/!C!: U16.37(D/!C!) ; also sheet 1
TIM0_CC1_TFT_BL: R38.1 ; also sheet 1
US2_CLK_TFT: U16.36(!WR!/SCL) ; also sheet 1
US2_MISO_TFT: U16.33(SDO) ; also sheet 1
US2_MOSI_TFT: U16.34(SDA) ; also sheet 1
Unconnected: U16.39(TE)

## Sheet 7 of 9: User Interface
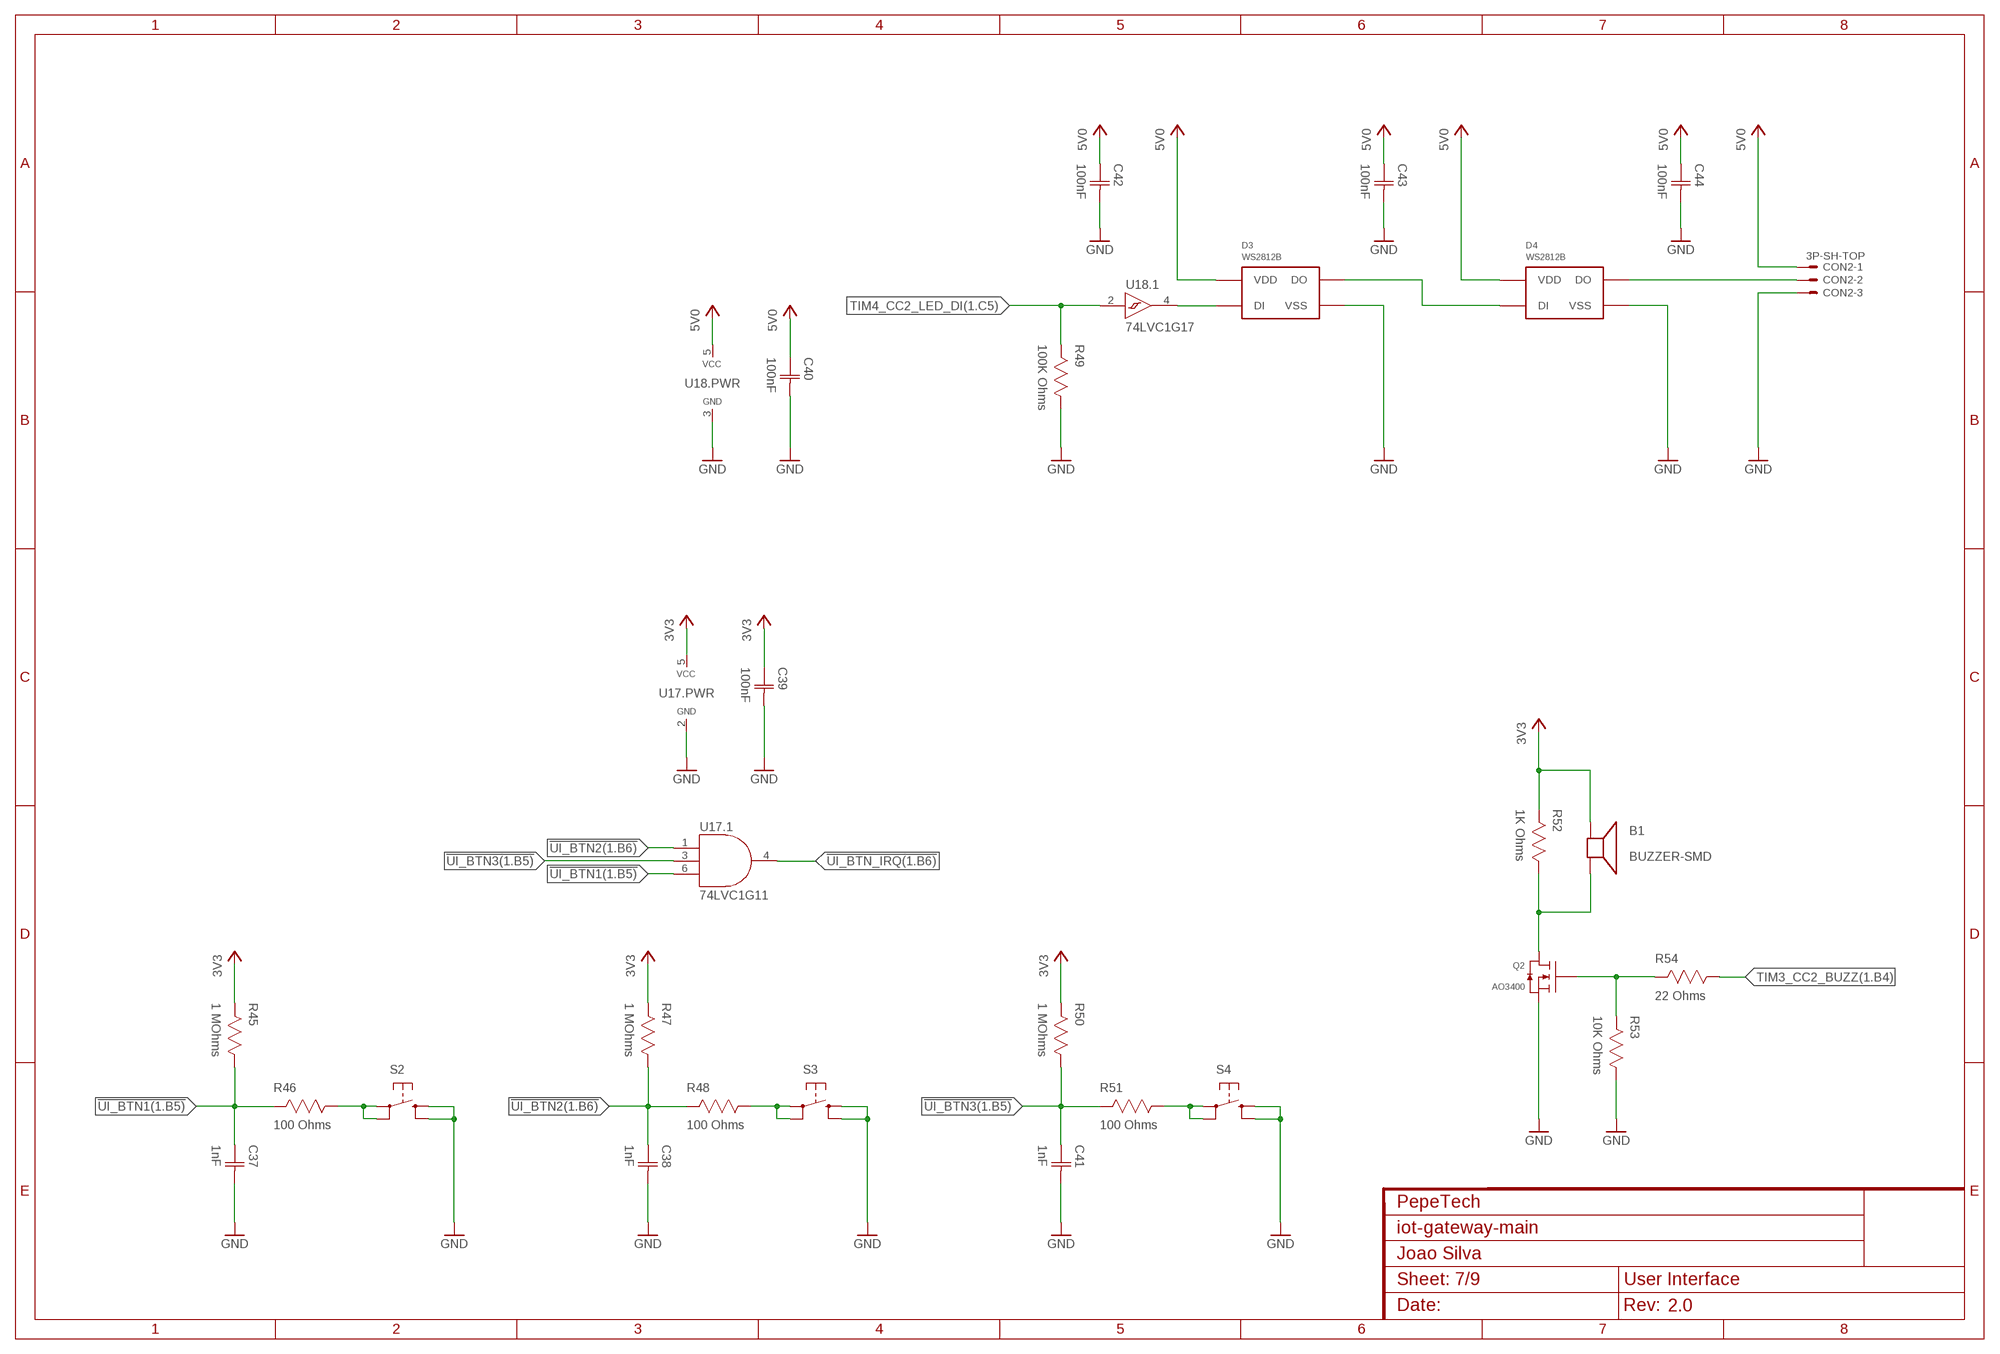
[diagram p7: schematic, sheet 7]

### Parts
B1  BUZZER-SMD  [SMD]
C37  1nF  CAPACITOR-0603  [CAP0603]
C38  1nF  CAPACITOR-0603  [CAP0603]
C39  100nF  CAPACITOR-0603  [CAP0603]
C40  100nF  CAPACITOR-0603  [CAP0603]
C41  1nF  CAPACITOR-0603  [CAP0603]
C42  100nF  CAPACITOR-0603  [CAP0603]
C43  100nF  CAPACITOR-0603  [CAP0603]
C44  100nF  CAPACITOR-0603  [CAP0603]
CON2  3P-SH-TOP  [SH-03-TOP]
D3  WS2812B  WS2812B-SMD5050  [WS2812B-SMD5050]
D4  WS2812B  WS2812B-SMD5050  [WS2812B-SMD5050]
Q2  AO3400  [SOT23]
R45  1 MOhms  RESISTOR-0603  [RES0603]
R46  100 Ohms  RESISTOR-0603  [RES0603]
R47  1 MOhms  RESISTOR-0603  [RES0603]
R48  100 Ohms  RESISTOR-0603  [RES0603]
R49  100K Ohms  RESISTOR-0603  [RES0603]
R50  1 MOhms  RESISTOR-0603  [RES0603]
R51  100 Ohms  RESISTOR-0603  [RES0603]
R52  1K Ohms  RESISTOR-0603  [RES0603]
R53  10K Ohms  RESISTOR-0603  [RES0603]
R54  22 Ohms  RESISTOR-0603  [RES0603]
S2  TAC_SWITCHSMD_4.5X4.5  [TAC_SW_SMD_4.5X4.5]
S3  TAC_SWITCHSMD_4.5X4.5  [TAC_SW_SMD_4.5X4.5]
S4  TAC_SWITCHSMD_4.5X4.5  [TAC_SW_SMD_4.5X4.5]
U17  74LVC1G11  [SC70-6]
U18  74LVC1G17  [SC70-5]

### Nets
3V3: B1.1(+) C39.1(C1) R45.2 R47.2 R50.2 R52.2 U17.5(.PWR:VCC) ; also sheet 1,2,3,4,5,6,8,9
5V0: C40.1(C1) C42.1(C1) C43.1(C1) C44.1(C1) CON2.1 D3.1(VDD) D4.1(VDD) U18.5(.PWR:VCC) ; also sheet 8,9
!UI_BTN1: C37.1(C1) R45.1 R46.2 U17.6(.1:C) ; also sheet 1
!UI_BTN2: C38.1(C1) R47.1 R48.2 U17.1(.1:A) ; also sheet 1
!UI_BTN3: C41.1(C1) R50.1 R51.2 U17.3(.1:B) ; also sheet 1
!UI_BTN_IRQ: U17.4(.1:Y) ; also sheet 1
BUZZ_DRV: B1.2(-) Q2.3(D) R52.1
EXT_LED_DI: CON2.2 D4.2(DO)
GND: C37.2(C2) C38.2(C2) C39.2(C2) C40.2(C2) C41.2(C2) C42.2(C2) C43.2(C2) C44.2(C2) CON2.3 D3.3(VSS) D4.3(VSS) Q2.2(S) R49.1 R53.1 S2.3 S2.4 S3.3 S3.4 S4.3 S4.4 U17.2(.PWR:GND) U18.3(.PWR:GND) ; also sheet 1,2,3,4,5,6,8,9
LED1_DI: D3.4(DI) U18.4(.1:Y)
LED2_DI: D3.2(DO) D4.4(DI)
N$34: Q2.1(G) R53.2 R54.2
N$53: R46.1 S2.1 S2.2
N$57: R51.1 S4.1 S4.2
N$59: R48.1 S3.1 S3.2
TIM3_CC2_BUZZ: R54.1 ; also sheet 1
TIM4_CC2_LED_DI: R49.2 U18.2(.1:A) ; also sheet 1

## Sheet 8 of 9: USB/Power Interface
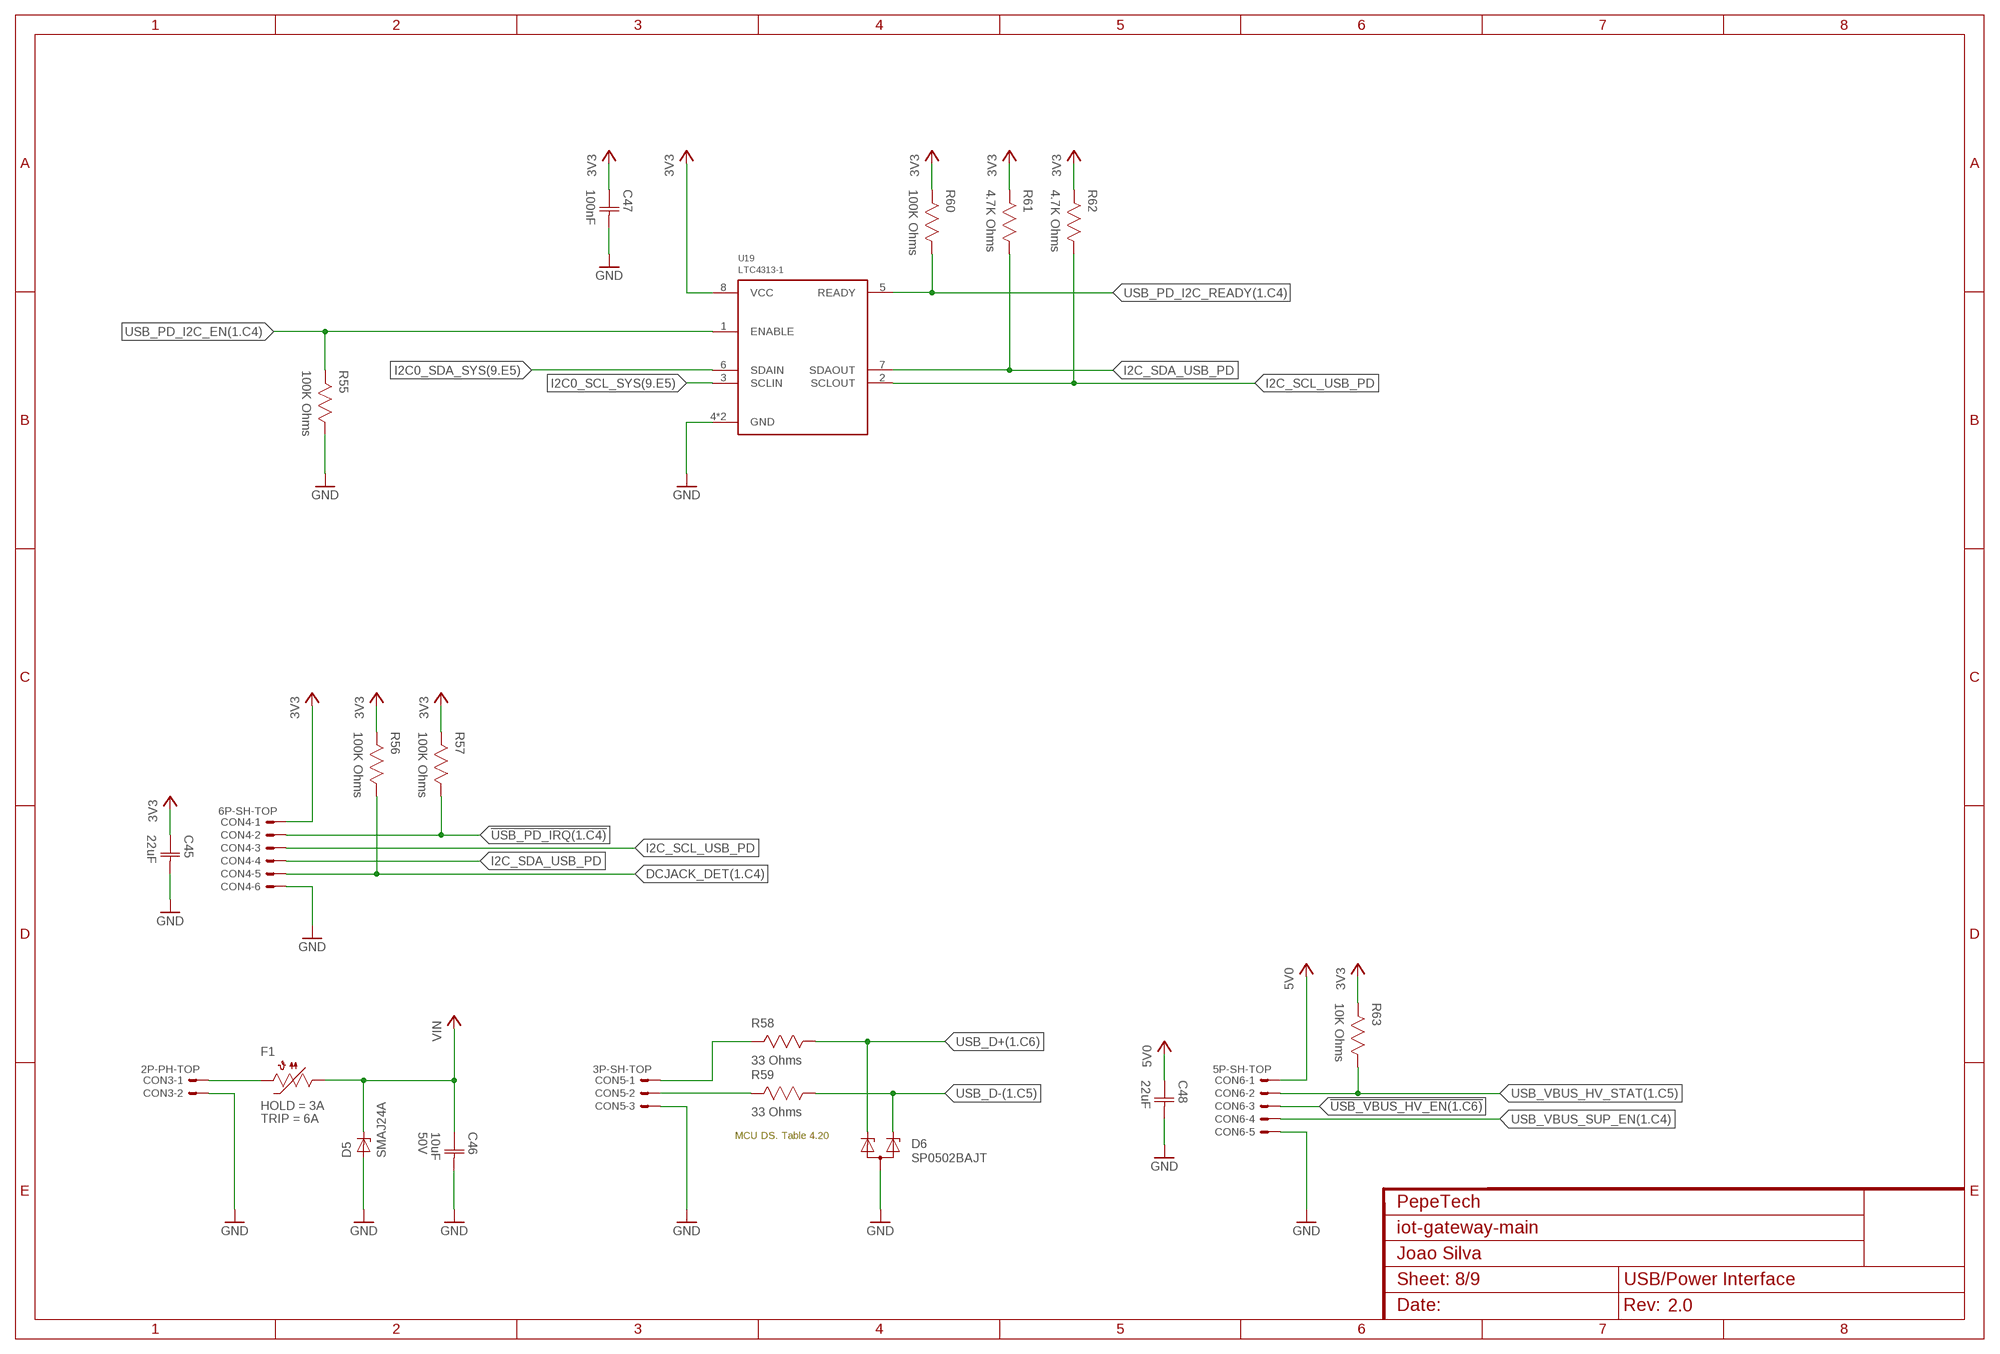
[diagram p8: schematic, sheet 8]

### Parts
C45  22uF  CAPACITOR-1206  [CAP1206]
C46  10uF  CAPACITOR-1206  [CAP1206]
C47  100nF  CAPACITOR-0603  [CAP0603]
C48  22uF  CAPACITOR-1206  [CAP1206]
CON3  2P-PH-TOP  [PH-02-TOP]
CON4  6P-SH-TOP  [SH-06-TOP]
CON5  3P-SH-TOP  [SH-03-TOP]
CON6  5P-SH-TOP  [SH-05-TOP]
D5  SMAJ24A  [DO214AC]
D6  SP0502BAJT  [SC70-3]
F1  2.6A Hold  PTC1206  [1206]
R55  100K Ohms  RESISTOR-0603  [RES0603]
R56  100K Ohms  RESISTOR-0603  [RES0603]
R57  100K Ohms  RESISTOR-0603  [RES0603]
R58  33 Ohms  RESISTOR-0603  [RES0603]
R59  33 Ohms  RESISTOR-0603  [RES0603]
R60  100K Ohms  RESISTOR-0603  [RES0603]
R61  4.7K Ohms  RESISTOR-0603  [RES0603]
R62  4.7K Ohms  RESISTOR-0603  [RES0603]
R63  10K Ohms  RESISTOR-0603  [RES0603]
U19  LTC4313-1  [DFN8]

### Nets
3V3: C45.1(C1) C47.1(C1) CON4.1 R56.2 R57.2 R60.2 R61.2 R62.2 R63.2 U19.8(VCC) ; also sheet 1,2,3,4,5,6,7,9
5V0: C48.1(C1) CON6.1 ; also sheet 7,9
!USB_PD_IRQ: CON4.2 R57.1 ; also sheet 1
!USB_VBUS_HV_EN: CON6.3 ; also sheet 1
DCJACK_DET: CON4.5 R56.1 ; also sheet 1
GND: C45.2(C2) C46.2(C2) C47.2(C2) C48.2(C2) CON3.2 CON4.6 CON5.3 CON6.5 D5.A D6.3(A) R55.1 U19.4(GND) U19.9(GND) ; also sheet 1,2,3,4,5,6,7,9
I2C0_SCL_SYS: U19.3(SCLIN) ; also sheet 1,6,9
I2C0_SDA_SYS: U19.6(SDAIN) ; also sheet 1,6,9
I2C_SCL_USB_PD: CON4.3 R62.1 U19.2(SCLOUT)
I2C_SDA_USB_PD: CON4.4 R61.1 U19.7(SDAOUT)
N$63: CON5.2 R59.2
N$64: CON5.1 R58.2
USB_D+: D6.1(C1) R58.1 ; also sheet 1
USB_D-: D6.2(C2) R59.1 ; also sheet 1
USB_PD_I2C_EN: R55.2 U19.1(ENABLE) ; also sheet 1
USB_PD_I2C_READY: R60.1 U19.5(READY) ; also sheet 1
USB_VBUS_HV_STAT: CON6.2 R63.1 ; also sheet 1
USB_VBUS_SUP_EN: CON6.4 ; also sheet 1
VIN: C46.1(C1) D5.C F1.1 ; also sheet 9
VIN_UNFUSED: CON3.1 F1.2

### Notes on the sheet
- MCU DS. Table 4.20

## Sheet 9 of 9: Power Management
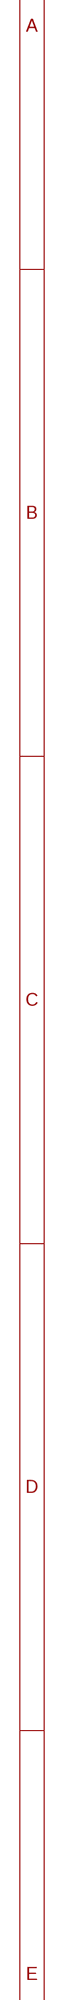
[diagram p9: schematic, sheet 9, part 1 of 2]
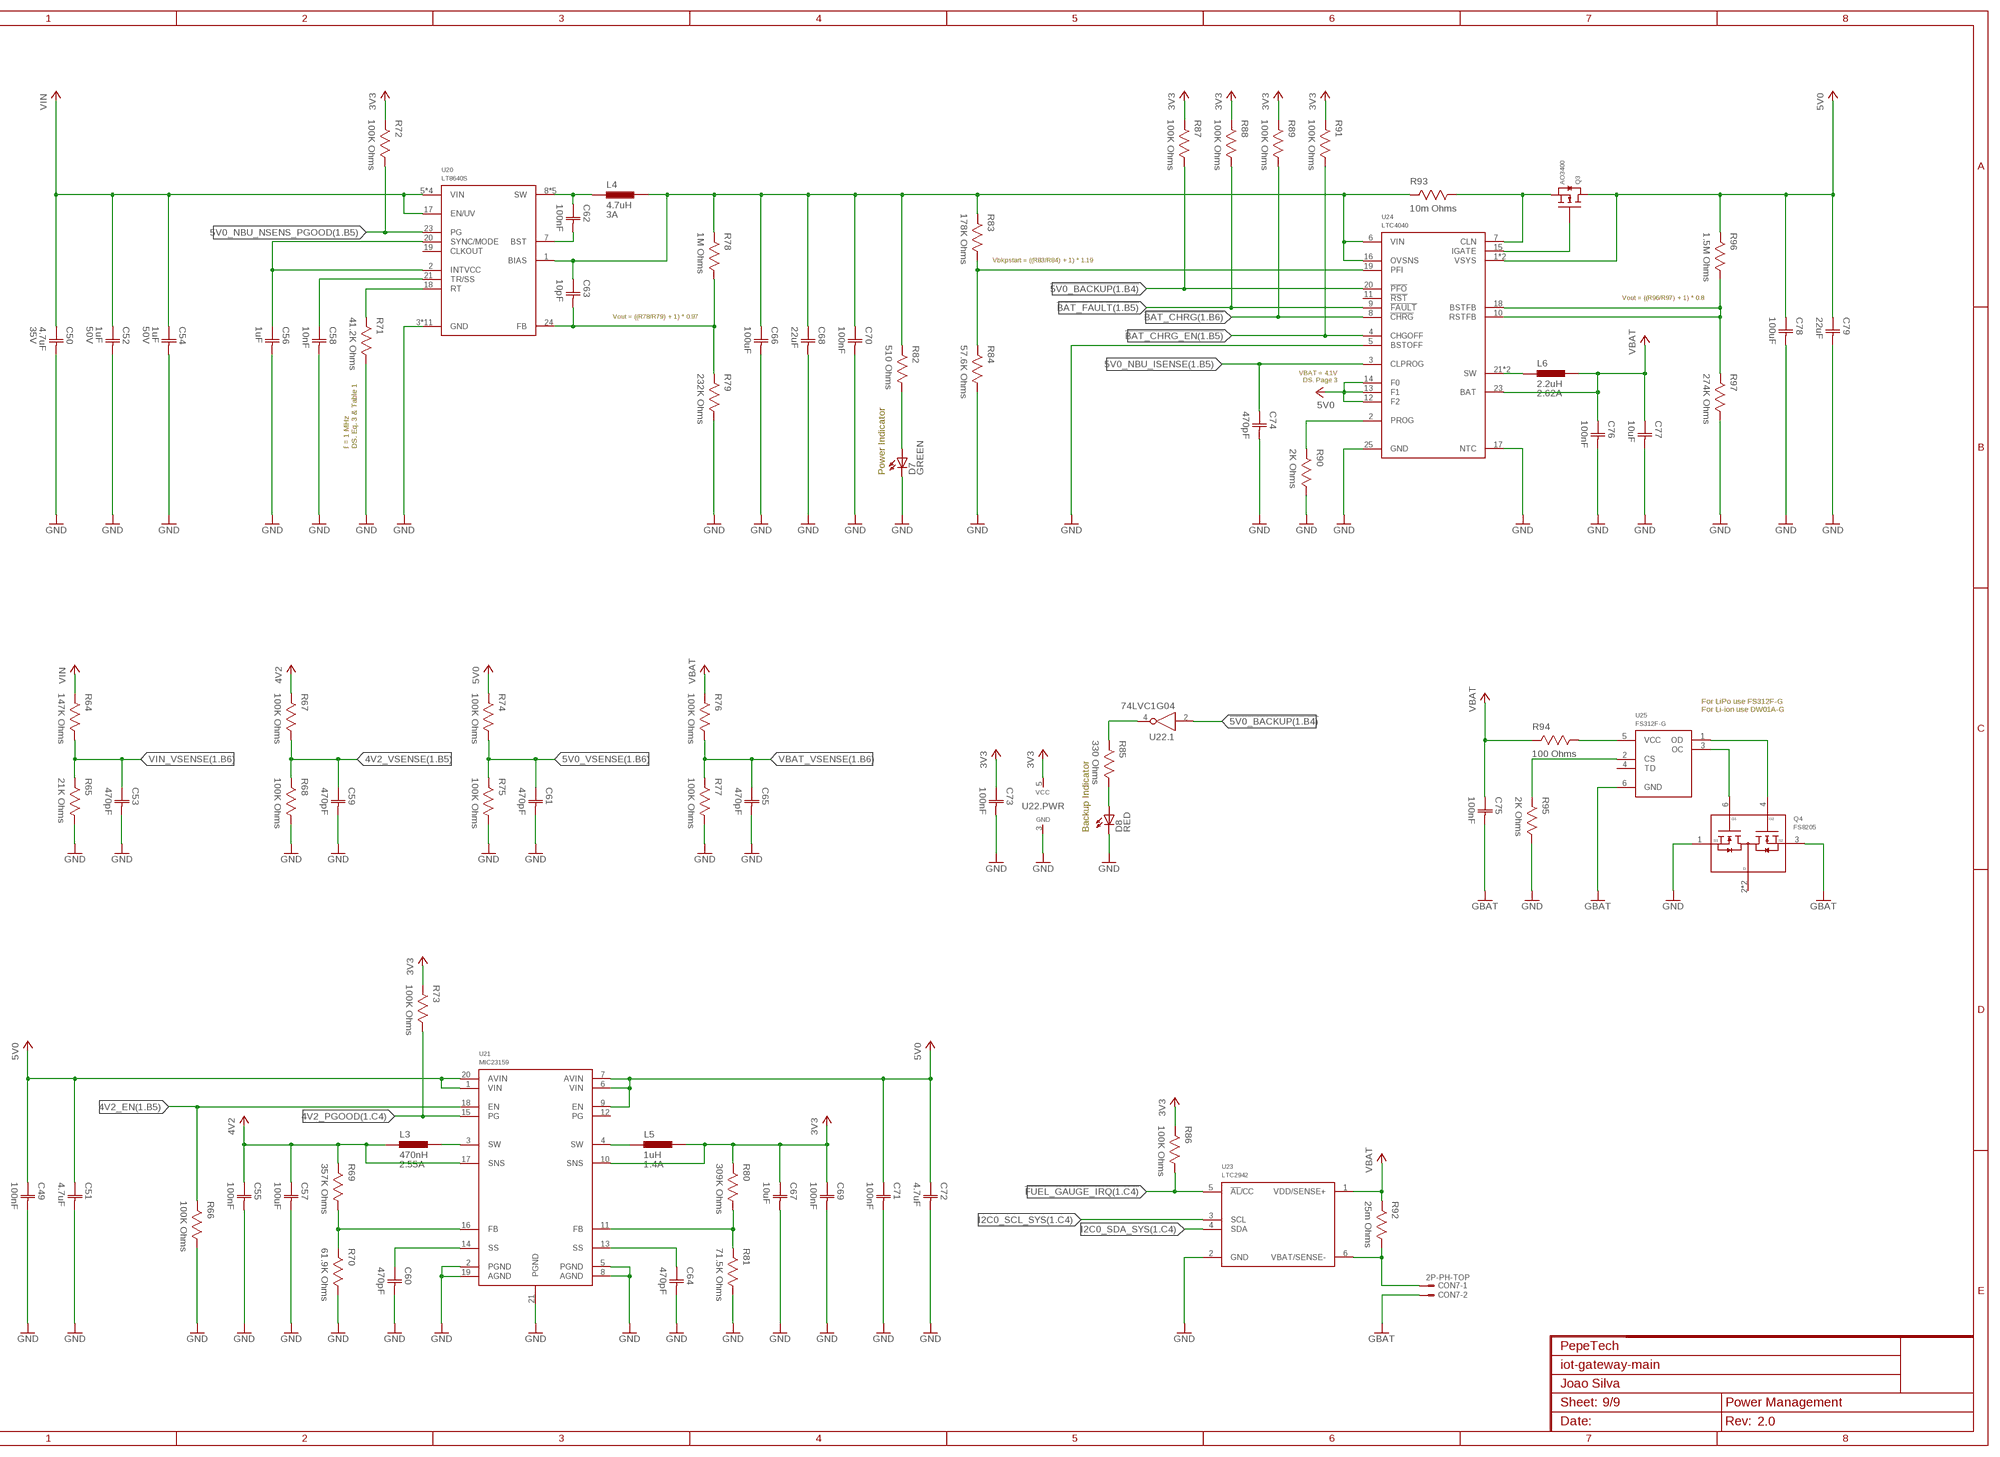
[diagram p10: schematic, sheet 9, part 2 of 2]

### Parts
C49  100nF  CAPACITOR-0603  [CAP0603]
C50  4.7uF  CAPACITOR-0603  [CAP0603]
C51  4.7uF  CAPACITOR-0603  [CAP0603]
C52  1uF  CAPACITOR-0603  [CAP0603]
C53  470pF  CAPACITOR-0603  [CAP0603]
C54  1uF  CAPACITOR-0603  [CAP0603]
C55  100nF  CAPACITOR-0603  [CAP0603]
C56  1uF  CAPACITOR-0603  [CAP0603]
C57  100uF  CAPACITOR-1206  [CAP1206]
C58  10nF  CAPACITOR-0603  [CAP0603]
C59  470pF  CAPACITOR-0603  [CAP0603]
C60  470pF  CAPACITOR-0603  [CAP0603]
C61  470pF  CAPACITOR-0603  [CAP0603]
C62  100nF  CAPACITOR-0603  [CAP0603]
C63  10pF  CAPACITOR-0603  [CAP0603]
C64  470pF  CAPACITOR-0603  [CAP0603]
C65  470pF  CAPACITOR-0603  [CAP0603]
C66  100uF  CAPACITOR-1206  [CAP1206]
C67  10uF  CAPACITOR-0603  [CAP0603]
C68  22uF  CAPACITOR-1206  [CAP1206]
C69  100nF  CAPACITOR-0603  [CAP0603]
C70  100nF  CAPACITOR-0603  [CAP0603]
C71  100nF  CAPACITOR-0603  [CAP0603]
C72  4.7uF  CAPACITOR-0603  [CAP0603]
C73  100nF  CAPACITOR-0603  [CAP0603]
C74  470pF  CAPACITOR-0603  [CAP0603]
C75  100nF  CAPACITOR-0603  [CAP0603]
C76  100nF  CAPACITOR-0603  [CAP0603]
C77  10uF  CAPACITOR-0603  [CAP0603]
C78  100uF  CAPACITOR-1206  [CAP1206]
C79  22uF  CAPACITOR-1206  [CAP1206]
CON7  2P-PH-TOP  [PH-02-TOP]
D7  LED1206-REV  [1206_REV]
D8  RED  LED1206-REV  [1206_REV]
L3  470nH  INDUCTOR-3.2XX2.5MM  [IND3225]
L4  4.7uH  INDUCTOR-6X6MM  [IND0606]
L5  1uH  INDUCTOR-0805  [IND0805]
L6  2.2uH  INDUCTOR-5X5MM  [IND0505]
Q3  AO3400  [SOT23]
Q4  FS8205  [SOT23-6]
R64  147K Ohms  RESISTOR-0603  [RES0603]
R65  21K Ohms  RESISTOR-0603  [RES0603]
R66  100K Ohms  RESISTOR-0603  [RES0603]
R67  100K Ohms  RESISTOR-0603  [RES0603]
R68  100K Ohms  RESISTOR-0603  [RES0603]
R69  357K Ohms  RESISTOR-0603  [RES0603]
R70  61.9K Ohms  RESISTOR-0603  [RES0603]
R71  41.2K Ohms  RESISTOR-0603  [RES0603]
R72  100K Ohms  RESISTOR-0603  [RES0603]
R73  100K Ohms  RESISTOR-0603  [RES0603]
R74  100K Ohms  RESISTOR-0603  [RES0603]
R75  100K Ohms  RESISTOR-0603  [RES0603]
R76  100K Ohms  RESISTOR-0603  [RES0603]
R77  100K Ohms  RESISTOR-0603  [RES0603]
R78  1M Ohms  RESISTOR-0603  [RES0603]
R79  232K Ohms  RESISTOR-0603  [RES0603]
R80  309K Ohms  RESISTOR-0603  [RES0603]
R81  71.5K Ohms  RESISTOR-0603  [RES0603]
R82  510 Ohms  RESISTOR-0603  [RES0603]
R83  178K Ohms  RESISTOR-0603  [RES0603]
R84  57.6K Ohms  RESISTOR-0603  [RES0603]
R85  330 Ohms  RESISTOR-0603  [RES0603]
R86  100K Ohms  RESISTOR-0603  [RES0603]
R87  100K Ohms  RESISTOR-0603  [RES0603]
R88  100K Ohms  RESISTOR-0603  [RES0603]
R89  100K Ohms  RESISTOR-0603  [RES0603]
R90  2K Ohms  RESISTOR-0603  [RES0603]
R91  100K Ohms  RESISTOR-0603  [RES0603]
R92  25m Ohms  RESISTOR-1206  [RES1206]
R93  10m Ohms  RESISTOR-1206  [RES1206]
R94  100 Ohms  RESISTOR-0603  [RES0603]
R95  2K Ohms  RESISTOR-0603  [RES0603]
R96  1.5M Ohms  RESISTOR-0603  [RES0603]
R97  274K Ohms  RESISTOR-0603  [RES0603]
U20  LT8640S  [QFN24_CORNER]
U21  MIC23159  [VQFN20]
U22  74LVC1G04  [SC70-5]
U23  LTC2942  [DFN6]
U24  LTC4040  [QFN24_ASYM]
U25  FS312F-G  [SOT23-6]

### Nets
3V3: C67.1(C1) C69.1(C1) C73.1(C1) L5.2 R72.2 R73.2 R80.2 R86.2 R87.2 R88.2 R89.2 R91.2 U21.10(SNS) U22.5(.PWR:VCC) ; also sheet 1,2,3,4,5,6,7,8
3V3_FB: R80.1 R81.2 U21.11(FB)
3V3_SS: C64.1(C1) U21.13(SS)
3V3_SW: L5.1 U21.4(SW)
4V2: C55.1(C1) C57.1(C1) L3.1 R67.2 R69.2 U21.17(SNS) ; also sheet 4
4V2_EN: R66.2 U21.18(EN) ; also sheet 1
4V2_FB: R69.1 R70.2 U21.16(FB)
4V2_PGOOD: R73.1 U21.15(PG) ; also sheet 1
4V2_SS: C60.1(C1) U21.14(SS)
4V2_SW: L3.2 U21.3(SW)
4V2_VSENSE: C59.1(C1) R67.1 R68.2 ; also sheet 1
5V0: C49.1(C1) C51.1(C1) C71.1(C1) C72.1(C1) C78.1(C1) C79.1(C1) Q3.3(D) R74.2 R96.2 U21.1(VIN) U21.6(VIN) U21.7(AVIN) U21.9(EN) U21.20(AVIN) U24.1(VSYS) U24.12(F2) U24.13(F1) U24.14(F0) U24.24(VSYS) ; also sheet 7,8
5V0_BACKUP: R85.2 U22.4(.1:Y)
5V0_FB: R96.1 R97.2 U24.10(RSTFB) U24.18(BSTFB)
5V0_GATE: Q3.1(G) U24.15(IGATE)
5V0_NBU: Q3.2(S) R93.1 U24.7(CLN)
5V0_NBU_ISENSE: C74.1(C1) U24.3(CLPROG) ; also sheet 1
5V0_NBU_NSENS: C63.1(C1) C66.1(C1) C68.1(C1) C70.1(C1) L4.2 R78.2 R82.2 R83.2 R93.2 U20.1(BIAS) U24.6(VIN) U24.16(OVSNS)
5V0_NBU_NSENS_BST: C62.2(C2) U20.7(BST)
5V0_NBU_NSENS_FB: C63.2(C2) R78.1 R79.2 U20.24(FB)
5V0_NBU_NSENS_INTVCC: C56.1(C1) U20.2(INTVCC) U20.20(SYNC/MODE)
5V0_NBU_NSENS_PGOOD: R72.1 U20.23(PG) ; also sheet 1
5V0_NBU_NSENS_RT: R71.2 U20.18(RT)
5V0_NBU_NSENS_SS: C58.1(C1) U20.21(TR/SS)
5V0_NBU_NSENS_SW: C62.1(C1) L4.1 U20.8(SW) U20.9(SW) U20.10(SW) U20.11(SW) U20.12(SW)
5V0_VSENSE: C61.1(C1) R74.1 R75.2 ; also sheet 1
!5V0_BACKUP: R87.1 U22.2(.1:A) U24.20(!PFO) ; also sheet 1
!BAT_CHRG: R89.1 U24.8(!CHRG) ; also sheet 1
!BAT_CHRG_EN: R91.1 U24.4(CHGOFF) ; also sheet 1
!BAT_FAULT: R88.1 U24.9(!FAULT) ; also sheet 1
!FUEL_GAUGE_IRQ: R86.1 U23.5(!AL!/CC) ; also sheet 1
BAT_CHRG_PROG: R90.2 U24.2(PROG)
BAT_OC: Q4.6(G1) U25.3(OC)
BAT_OD: Q4.4(G2) U25.1(OD)
BAT_PROT_CS: R95.2 U25.2(CS)
BAT_PROT_VCC: R94.1 U25.5(VCC)
GBAT: C75.2(C2) CON7.2 Q4.3(S2) U25.6(GND)
GND: C49.2(C2) C50.2(C2) C51.2(C2) C52.2(C2) C53.2(C2) C54.2(C2) C55.2(C2) C56.2(C2) C57.2(C2) C58.2(C2) C59.2(C2) C60.2(C2) C61.2(C2) C64.2(C2) C65.2(C2) C66.2(C2) C67.2(C2) C68.2(C2) C69.2(C2) C70.2(C2) C71.2(C2) C72.2(C2) C73.2(C2) C74.2(C2) C76.2(C2) C77.2(C2) C78.2(C2) C79.2(C2) D7.C D8.C Q4.1(S1) R65.1 R66.1 R68.1 R70.1 R71.1 R75.1 R77.1 R79.1 R81.1 R84.1 R90.1 R95.1 R97.1 U20.3(GND) U20.16(GND) U20.22(GND) U20.25(GND) U20.26(GND) U20.27(GND) U20.28(GND) U20.29(GND) U20.30(GND) U20.31(GND) U20.32(GND) U21.2(PGND) U21.5(PGND) U21.8(AGND) U21.19(AGND) U21.21(PGND) U22.3(.PWR:GND) U23.2(GND) U24.5(BSTOFF) U24.17(NTC) U24.25(GND) ; also sheet 1,2,3,4,5,6,7,8
I2C0_SCL_SYS: U23.3(SCL) ; also sheet 1,6,8
I2C0_SDA_SYS: U23.4(SDA) ; also sheet 1,6,8
N$91: D7.A R82.1
N$92: D8.A R85.1
PF_THRESH: R83.1 R84.2 U24.19(PFI)
VBAT: C75.1(C1) C76.1(C1) C77.1(C1) L6.2 R76.2 R92.2 R94.2 U23.1(VDD/SENSE+) U24.23(BAT)
VBAT_NSENS: CON7.1 R92.1 U23.6(VBAT/SENSE-)
VBAT_SW: L6.1 U24.21(SW) U24.22(SW)
VBAT_VSENSE: C65.1(C1) R76.1 R77.2 ; also sheet 1
VIN: C50.1(C1) C52.1(C1) C54.1(C1) R64.2 U20.5(VIN) U20.6(VIN) U20.13(VIN) U20.14(VIN) U20.17(EN/UV) ; also sheet 8
VIN_VSENSE: C53.1(C1) R64.1 R65.2 ; also sheet 1
Unconnected: Q4.2(D12) Q4.5(D12) U20.19(CLKOUT) U21.12(PG) U24.11(!RST) U25.4(TD)

### Notes on the sheet
- Vbkpstart = ((R83/R84) + 1) * 1.19
- Vout = ((R96/R97) + 1) * 0.8
- Vout = ((R78/R79) + 1) * 0.97
- VBAT = 4.1V
  DS. Page 3
- f = 1 MHz
  DS. Eq. 3 & Table 1
- For LiPo use FS312F-G
  For Li-ion use DW01A-G

## Library data of the parts
B1 = Buzzer:BUZZER
C1-C45 C47-C49 C51 C53 C55-C79 = Capacitor:CAPACITOR
C46 C52 C54 = Capacitor:CAPACITOR; VOLTAGE: 50V
C50 = Capacitor:CAPACITOR; VOLTAGE: 35V
CON1 CON4 = JST:6P: Disconnectable Crimp style connector, 1.0mm pitch 6 contacts
CON2 CON5 = JST:3P: Disconnectable Crimp style connector, 1.0mm pitch 3 contacts
CON3 CON7 = JST:2P: Disconnectable Crimp style connector, 1.0mm pitch 2 contacts
CON6 = JST:5P: Disconnectable Crimp style connector, 1.0mm pitch 5 contacts
D1 = LED:LED; COLOR: BLUE
D2 = LED:LED; COLOR: WHITE
D3 D4 = LED:WS2812B
D5 = TVS:SMAJ*A: SMAJ Series TVS Diodes Source: http://www.littelfuse.com/~/media/electronics/datasheets/tvs_diodes/littelfuse_tvs_diode_smaj_datasheet.pdf.pdf; MF: Littelfuse; MPN: SMAJ24A; OC_FARNELL: 1886345; OC_NEWARK: 06R1865
D6 = TVS:SP0502BAJT
D7 = LED:LED; COLOR: GREEN; PURPOSE: Power Indicator
D8 = LED:LED; COLOR: RED; PURPOSE: Backup Indicator
E1 E2 = Antenna:2.4GHZ
F1 = PTC Fuses:PTC; HOLD: 3A; OCLCSC: C207041; TRIP: 6A
L1 = Inductor:INDUCTOR; OCLCSC: C281111
L2 = Inductor:INDUCTOR; OCLCSC: C142206
L3 = Inductor:INDUCTOR; CURRENT: 2.55A; OCLCSC: C341774
L4 = Inductor:INDUCTOR; CURRENT: 3A; OCLCSC: C326336
L5 = Inductor:INDUCTOR; CURRENT: 1.4A; OCLCSC: C281114
L6 = Inductor:INDUCTOR; CURRENT: 2.62A; OCLCSC: C114791
LOGO1 = Silkscreen:OSHW-LOGO: Open-Source Hardware (OSHW) Logo This logo indicates the piece of hardware it is found on incorporates a OSHW license and/or adheres to the definition of open source hardware found here: http://freedomdefined.org/OSHW
LOGO2 = Silkscreen:JS
LOGO3 = Silkscreen:GECKO
Q1-Q3 = Alpha Omega:AO3400
Q4 = Fortune:FS8205
R1-R51 R55-R91 R94-R97 = Resistor:RESISTOR
R52-R54 = Resistor:RESISTOR; MF: VISHAY
R92 = Resistor:RESISTOR; OCLCSC: C127700
R93 = Resistor:RESISTOR; OCLCSC: C175759
RFCON1-RFCON4 = RF Connector:RFCON
S1-S4 = Switch:TAC_SWITCH: Momentary Switch Button commonly used for reset or general input. Spark Fun Electronics SKU : COM-00097
SIM1 = SIM Holder:SIMHOLDER
T1 = Generic BJT:BC817; MF: FAIRCHILD SEMICONDUCTOR
TC1 = TagConnect:TC2050-IDC
TP1-TP14 = PADs:TESTPOINT
U1 = Microchip:SST26VF064B
U2 = EFM32:EFM32GG11B8*Q100
U3 = Microchip:SST26VF016B
U4 = Espressif:ESP82*
U5 = HopeRF:RFM69*
U6 U7 = Logic:74LVC1G332
U8 = Logic:74LVC1G32
U9 = Logic:74LVC1G08
U10 = SimCom:SIM800C
U11 = Silicon Labs:SI7021
U12 = Silicon Labs:SI7210
U13 = Bosch:BMP280
U14 = AMS:CCS811
U15 = AMS:TMG399*
U16 = BuyDisplay:ER-TFT035-6
U17 = Logic:74LVC1G11
U18 = Logic:74LVC1G17
U19 = Analog Devices:LTC4313-*
U20 = Analog Devices:LT8640S
U21 = Microchip:MIC23159
U22 = Logic:74LVC1G04
U23 = Analog Devices:LTC294*
U24 = Analog Devices:LTC4040
U25 = Fortune:FS312F-G
X1 = Crystal:CRYSTAL; OCLCSC: C122522
X2 = Crystal:CRYSTAL; OCLCSC: C145166
X3 = Crystal:CRYSTAL_4P; OCLCSC: C389891